# EAGLE schematic ntc08 (EAGLE 6.6.0)

## Sheet 1 of 2
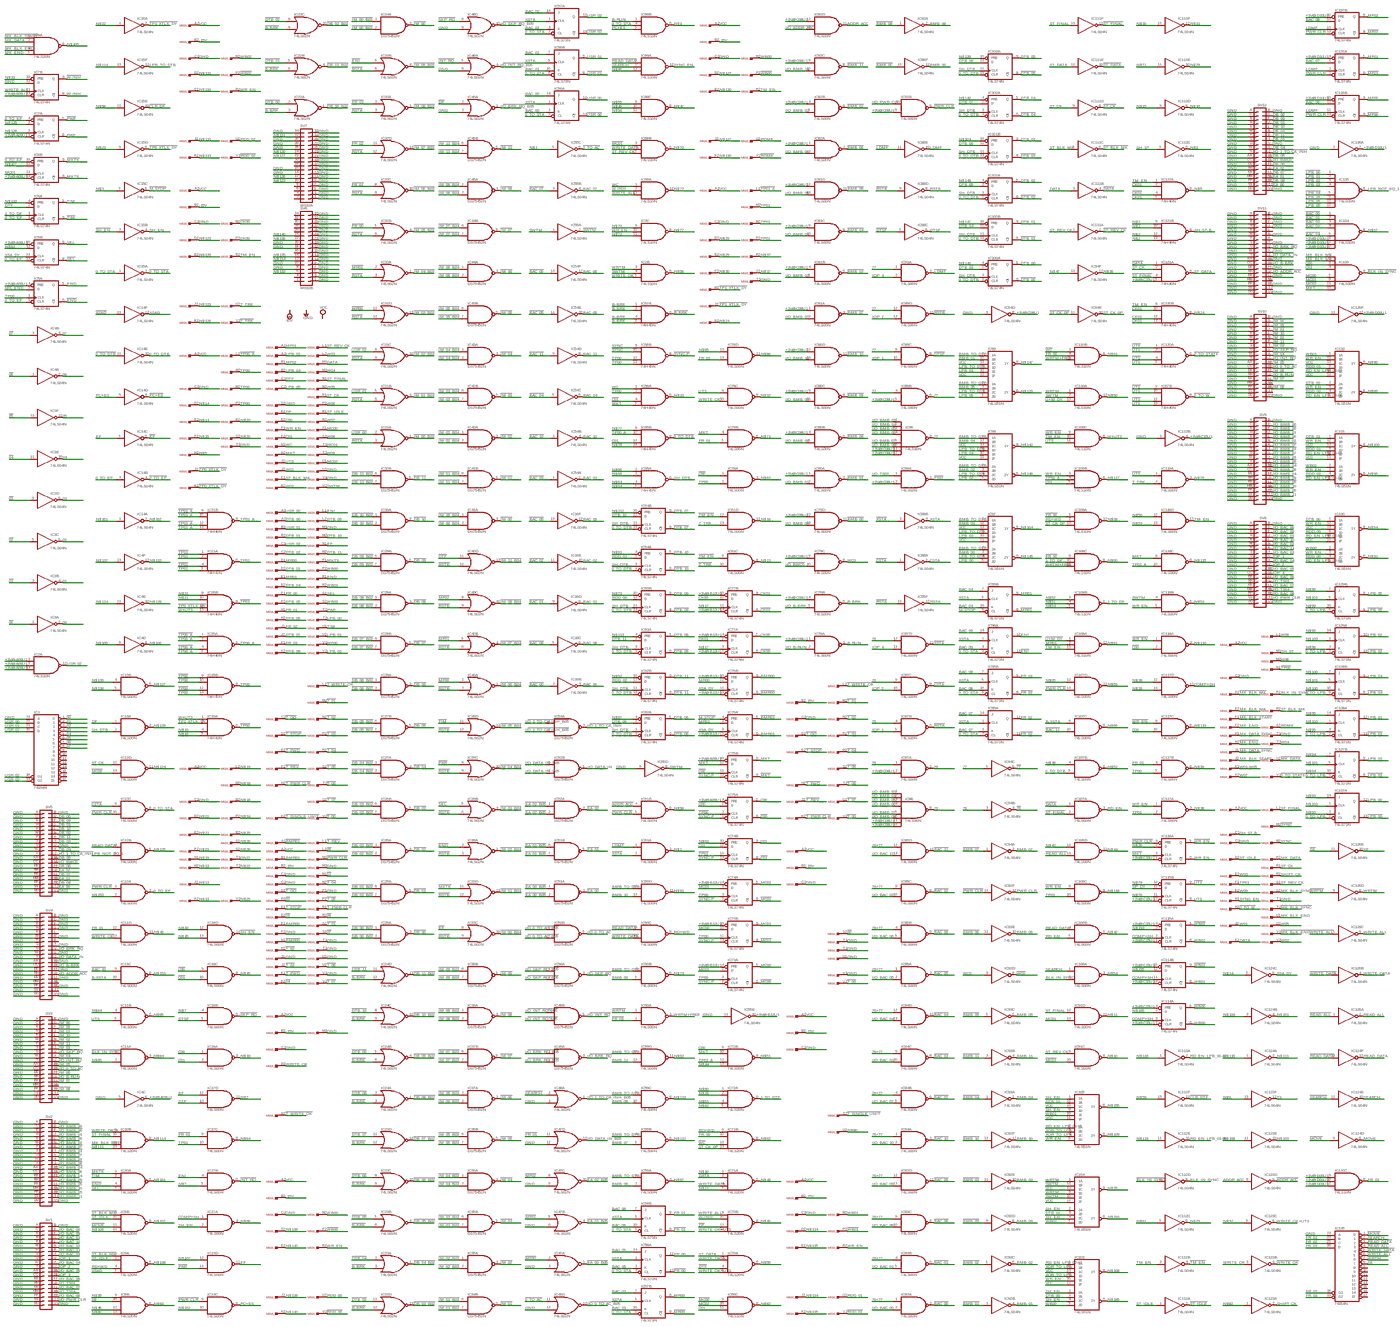
[diagram p0: schematic, sheet 1, overview]
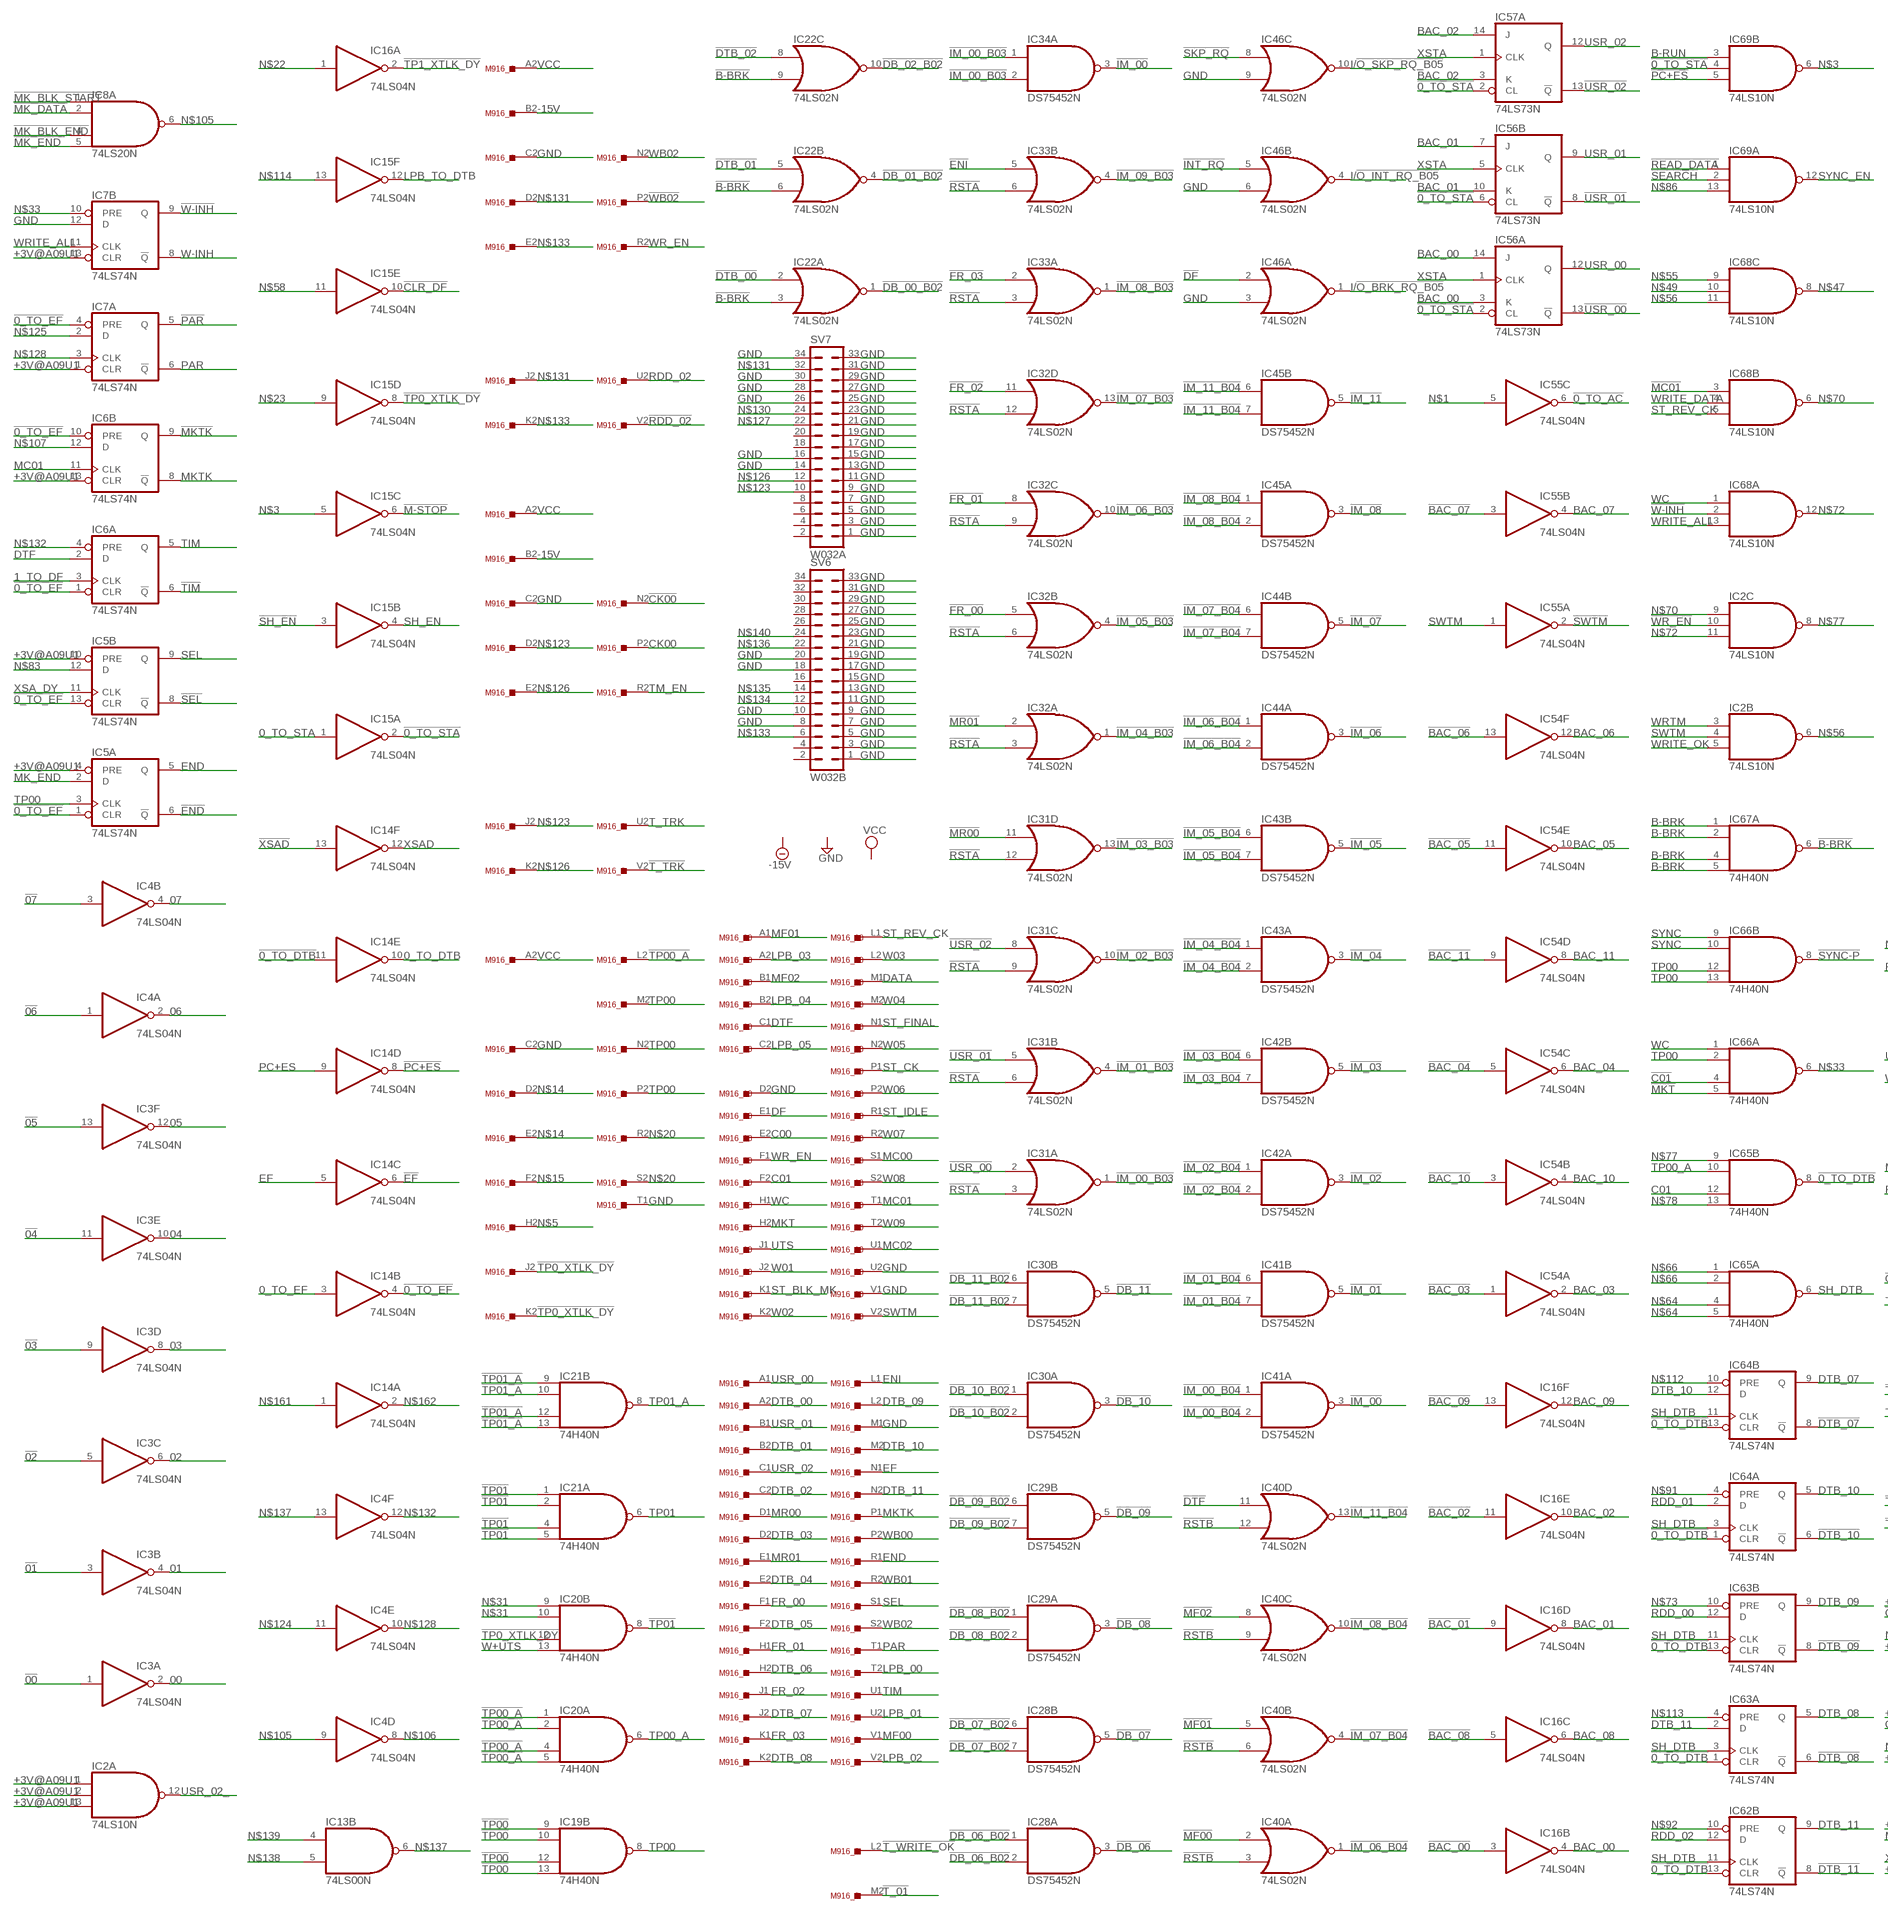
[diagram p1: schematic, sheet 1, part 1 of 4]
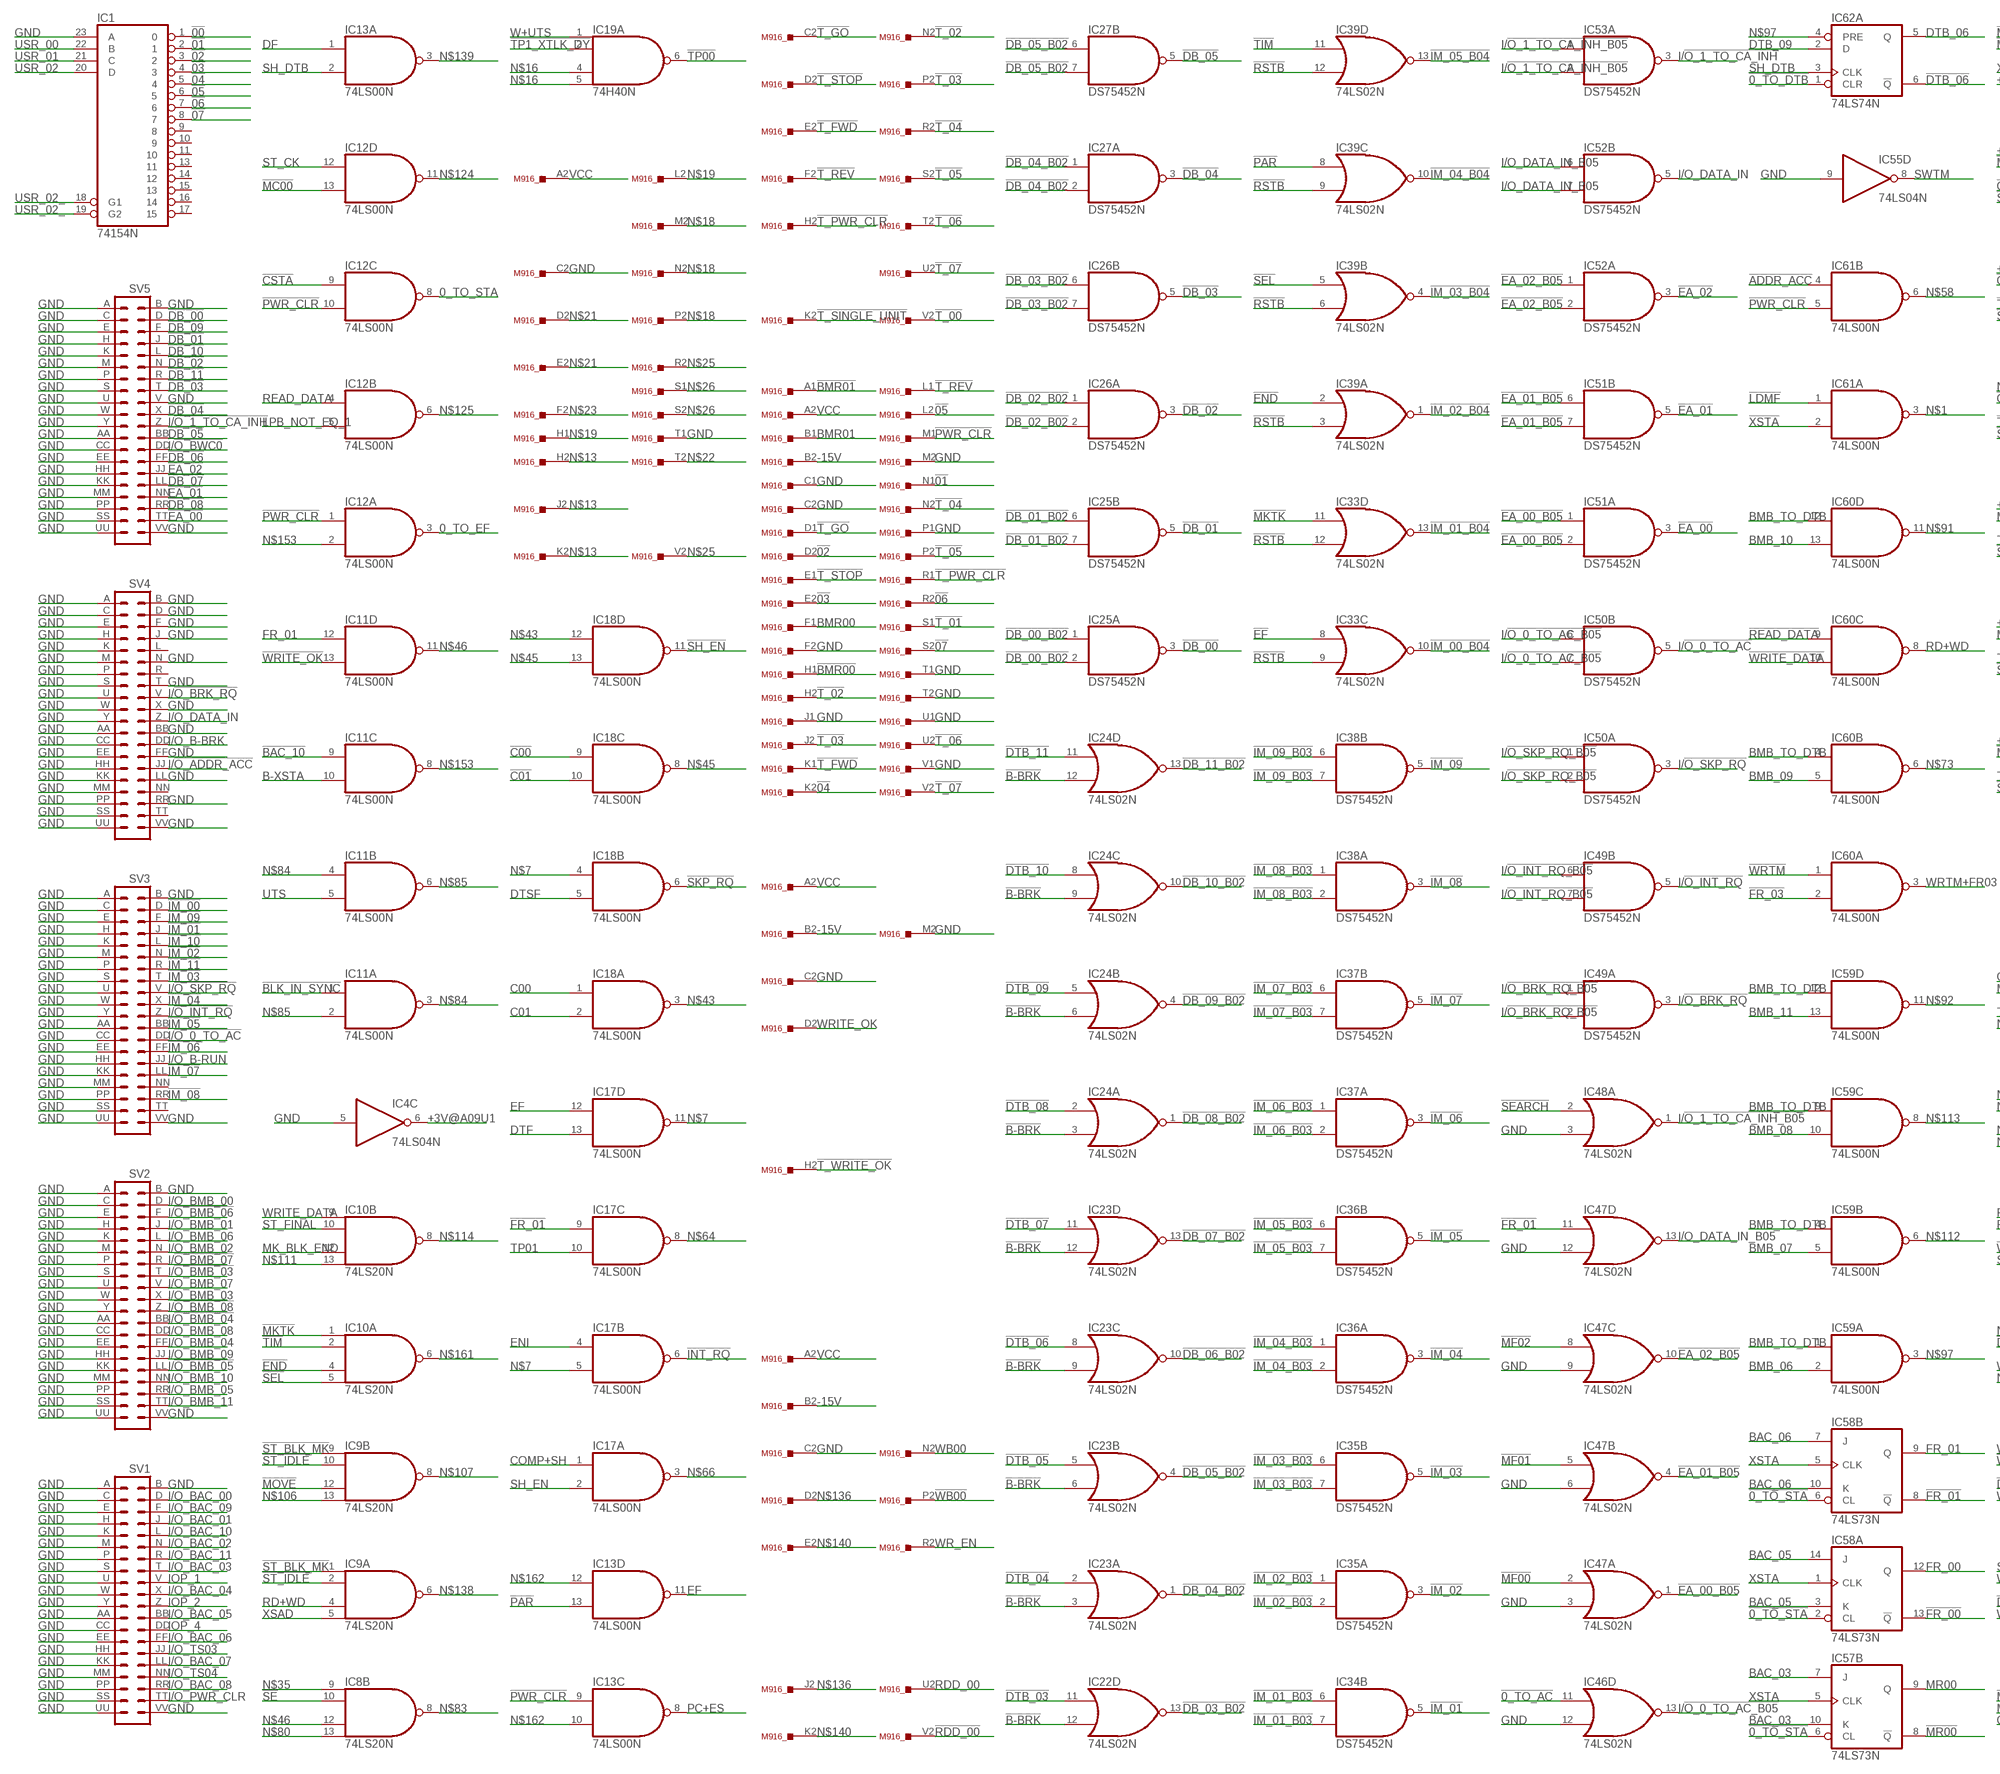
[diagram p2: schematic, sheet 1, part 2 of 4]
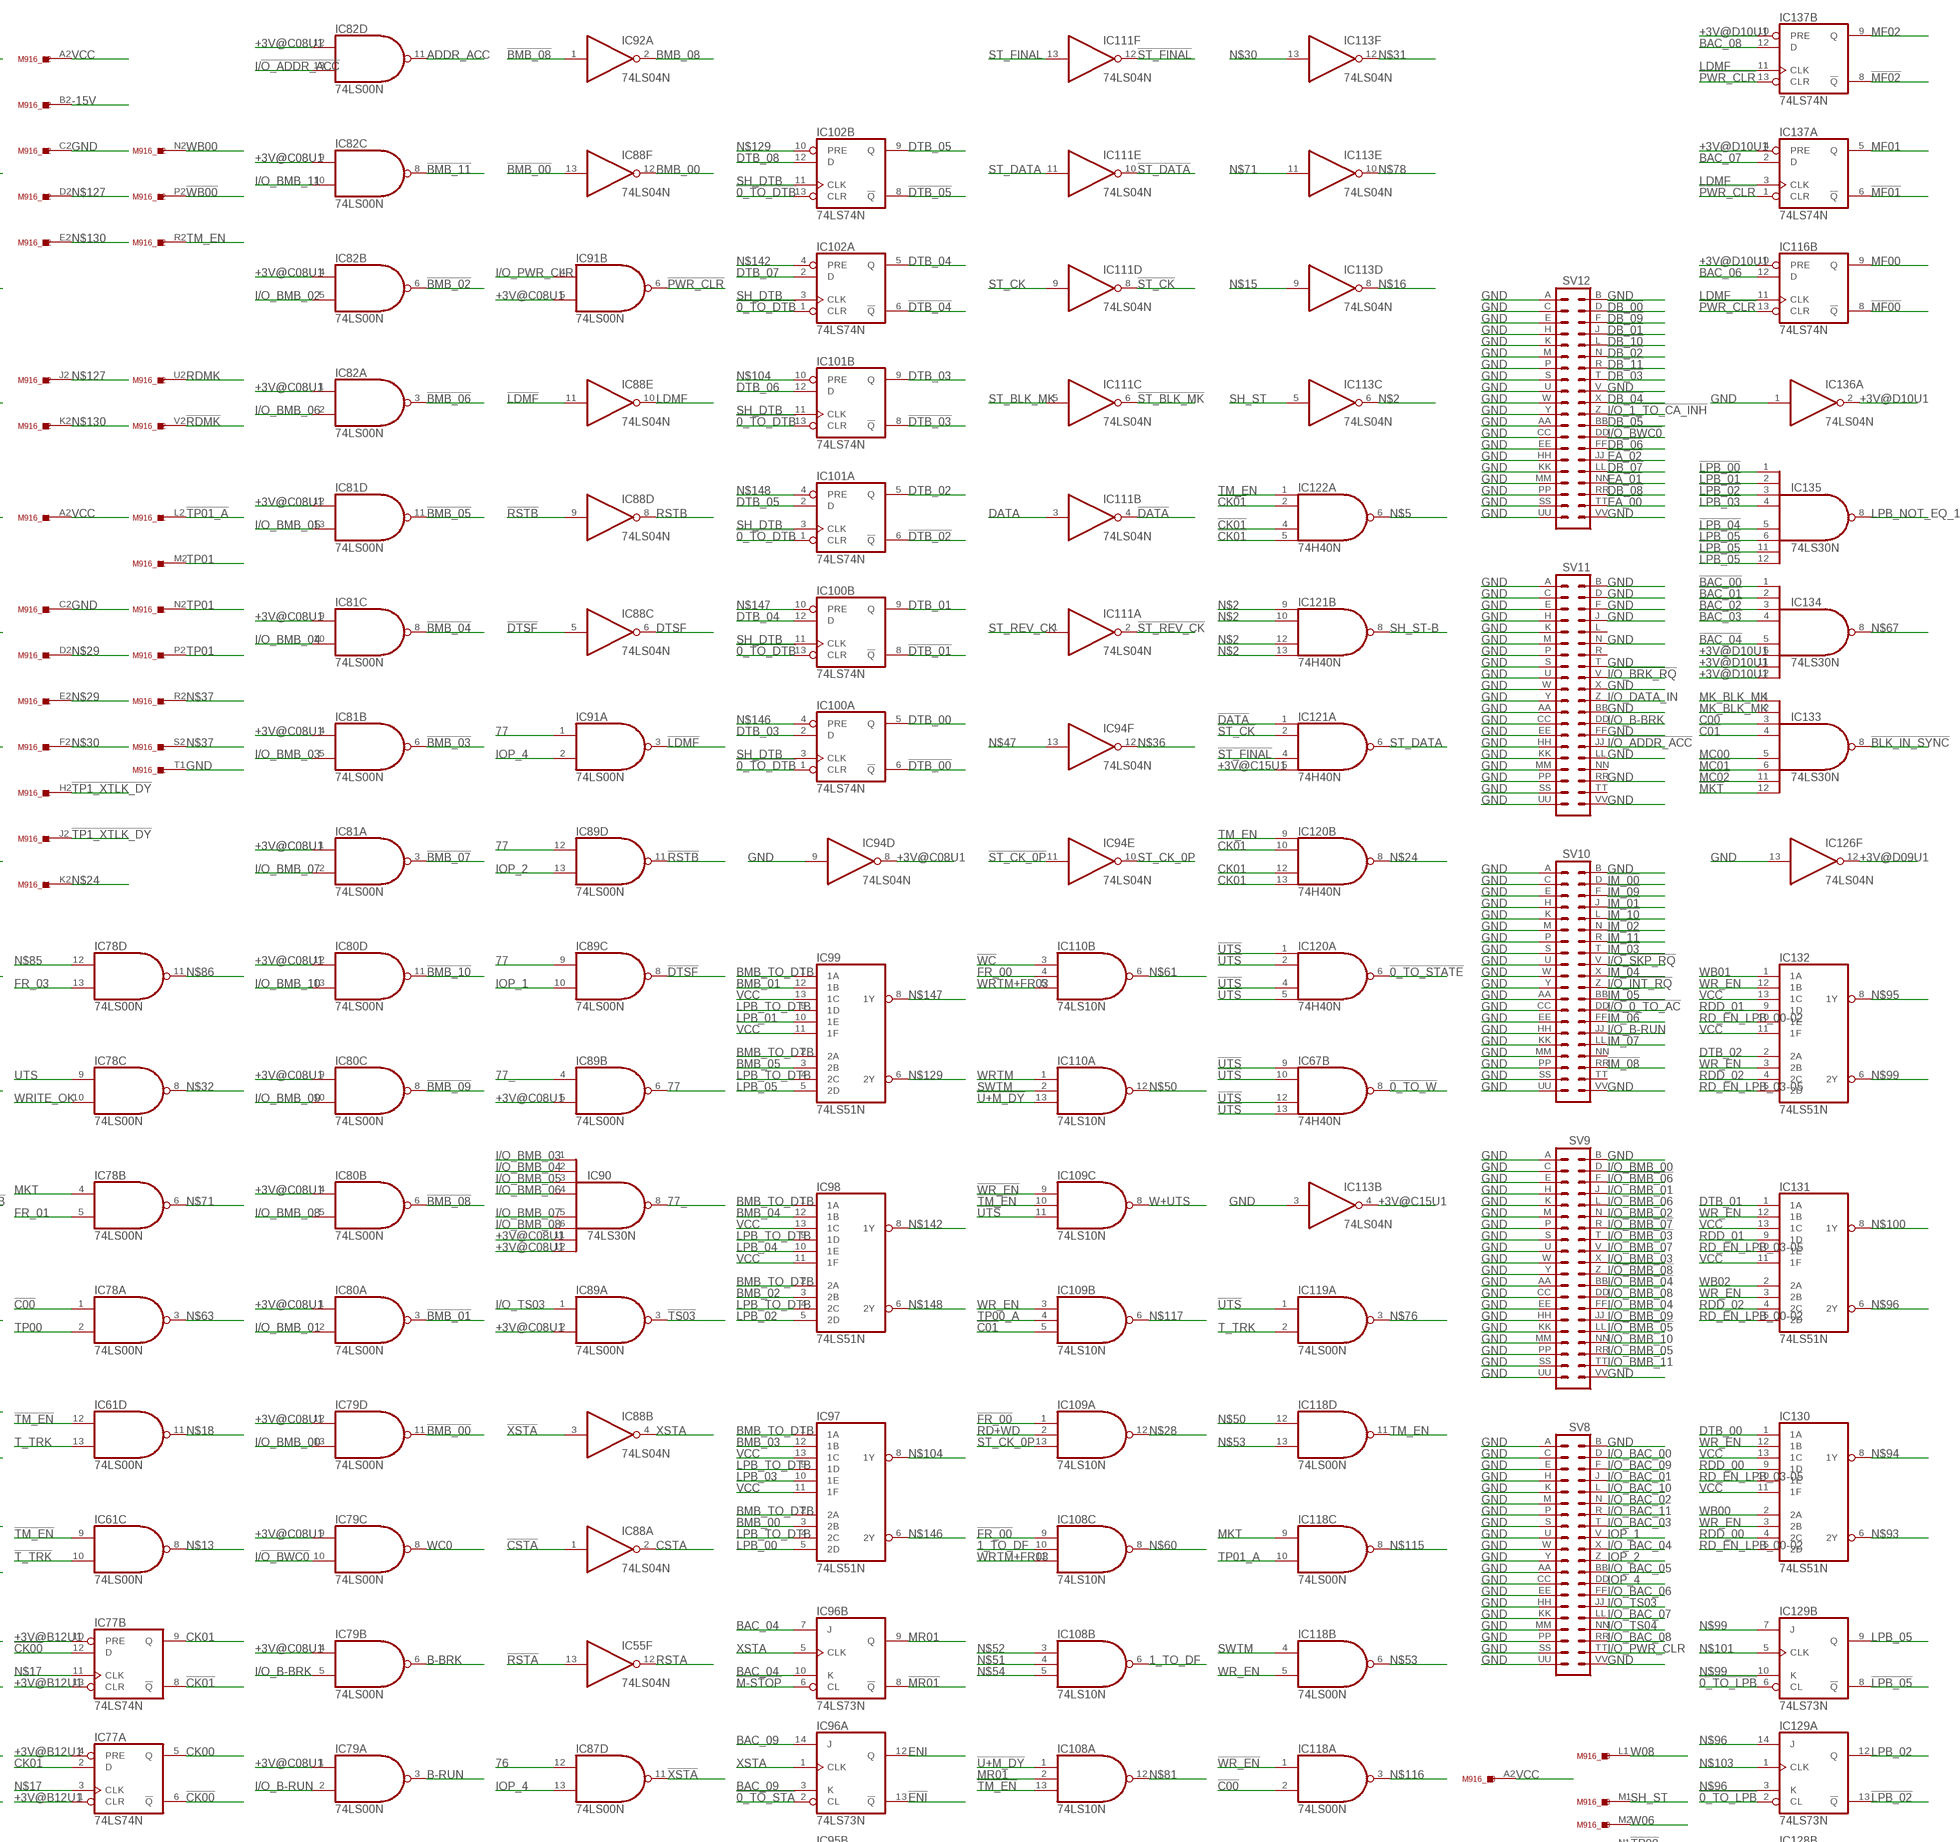
[diagram p3: schematic, sheet 1, part 3 of 4]
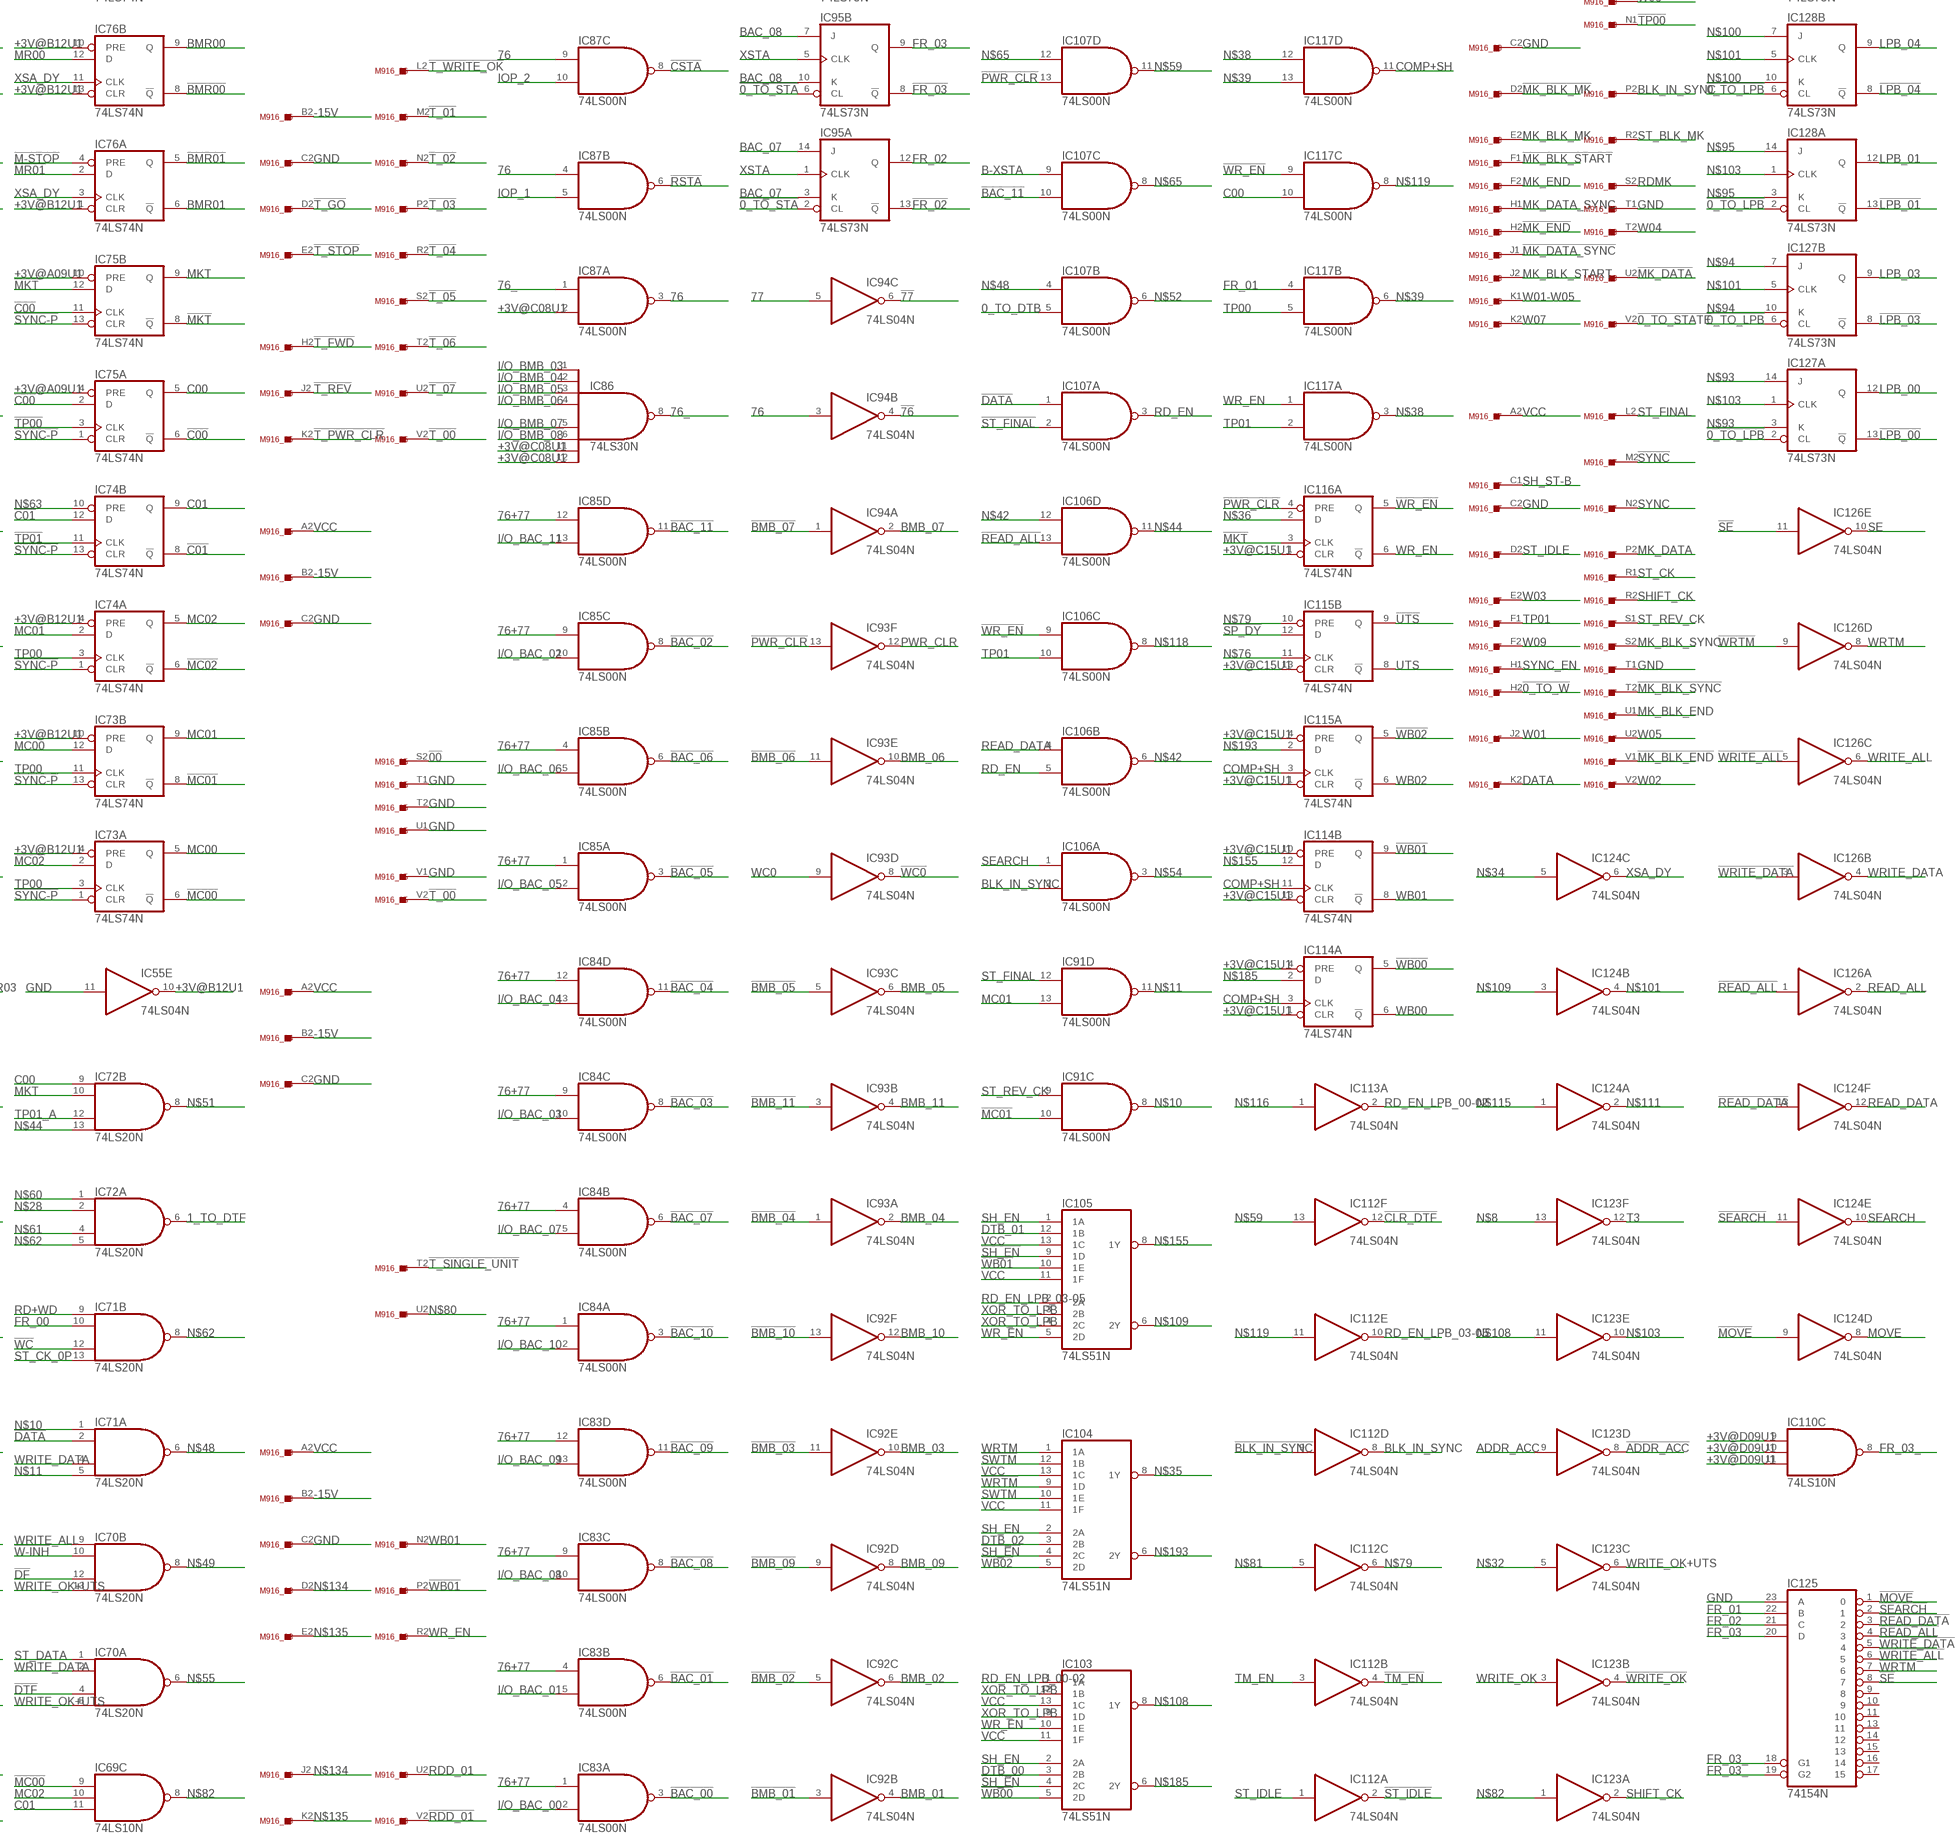
[diagram p4: schematic, sheet 1, part 4 of 4]

### Parts
IC1  74154N  [DIL24-6]
IC2  74LS10N  [DIL14]
IC3  74LS04N  [DIL14]
IC4  74LS04N  [DIL14]
IC5  74LS74N  [DIL14]
IC6  74LS74N  [DIL14]
IC7  74LS74N  [DIL14]
IC8  74LS20N  [DIL14]
IC9  74LS20N  [DIL14]
IC10  74LS20N  [DIL14]
IC11  74LS00N  [DIL14]
IC12  74LS00N  [DIL14]
IC13  74LS00N  [DIL14]
IC14  74LS04N  [DIL14]
IC15  74LS04N  [DIL14]
IC16  74LS04N  [DIL14]
IC17  74LS00N  [DIL14]
IC18  74LS00N  [DIL14]
IC19  74H40N  74S20N  [DIL14]
IC20  74H40N  74S20N  [DIL14]
IC21  74H40N  74S20N  [DIL14]
IC22  74LS02N  [DIL14]
IC23  74LS02N  [DIL14]
IC24  74LS02N  [DIL14]
IC25  DS75452N  [DIL08]
IC26  DS75452N  [DIL08]
IC27  DS75452N  [DIL08]
IC28  DS75452N  [DIL08]
IC29  DS75452N  [DIL08]
IC30  DS75452N  [DIL08]
IC31  74LS02N  [DIL14]
IC32  74LS02N  [DIL14]
IC33  74LS02N  [DIL14]
IC34  DS75452N  [DIL08]
IC35  DS75452N  [DIL08]
IC36  DS75452N  [DIL08]
IC37  DS75452N  [DIL08]
IC38  DS75452N  [DIL08]
IC39  74LS02N  [DIL14]
IC40  74LS02N  [DIL14]
IC41  DS75452N  [DIL08]
IC42  DS75452N  [DIL08]
IC43  DS75452N  [DIL08]
IC44  DS75452N  [DIL08]
IC45  DS75452N  [DIL08]
IC46  74LS02N  [DIL14]
IC47  74LS02N  [DIL14]
IC48  74LS02N  [DIL14]
IC49  DS75452N  [DIL08]
IC50  DS75452N  [DIL08]
IC51  DS75452N  [DIL08]
IC52  DS75452N  [DIL08]
IC53  DS75452N  [DIL08]
IC54  74LS04N  [DIL14]
IC55  74LS04N  [DIL14]
IC56  74LS73N  [DIL14]
IC57  74LS73N  [DIL14]
IC58  74LS73N  [DIL14]
IC59  74LS00N  [DIL14]
IC60  74LS00N  [DIL14]
IC61  74LS00N  [DIL14]
IC62  74LS74N  [DIL14]
IC63  74LS74N  [DIL14]
IC64  74LS74N  [DIL14]
IC65  74H40N  74S20N  [DIL14]
IC66  74H40N  74S20N  [DIL14]
IC67  74H40N  74S20N  [DIL14]
IC68  74LS10N  [DIL14]
IC69  74LS10N  [DIL14]
IC70  74LS20N  [DIL14]
IC71  74LS20N  [DIL14]
IC72  74LS20N  [DIL14]
IC73  74LS74N  [DIL14]
IC74  74LS74N  [DIL14]
IC75  74LS74N  [DIL14]
IC76  74LS74N  [DIL14]
IC77  74LS74N  [DIL14]
IC78  74LS00N  [DIL14]
IC79  74LS00N  [DIL14]
IC80  74LS00N  [DIL14]
IC81  74LS00N  [DIL14]
IC82  74LS00N  [DIL14]
IC83  74LS00N  [DIL14]
IC84  74LS00N  [DIL14]
IC85  74LS00N  [DIL14]
IC86  74LS30N  [DIL14]
IC87  74LS00N  [DIL14]
IC88  74LS04N  [DIL14]
IC89  74LS00N  [DIL14]
IC90  74LS30N  [DIL14]
IC91  74LS00N  [DIL14]
IC92  74LS04N  [DIL14]
IC93  74LS04N  [DIL14]
IC94  74LS04N  [DIL14]
IC95  74LS73N  [DIL14]
IC96  74LS73N  [DIL14]
IC97  74LS51N  [DIL14]
IC98  74LS51N  [DIL14]
IC99  74LS51N  [DIL14]
IC100  74LS74N  [DIL14]
IC101  74LS74N  [DIL14]
IC102  74LS74N  [DIL14]
IC103  74LS51N  [DIL14]
IC104  74LS51N  [DIL14]
IC105  74LS51N  [DIL14]
IC106  74LS00N  [DIL14]
IC107  74LS00N  [DIL14]
IC108  74LS10N  [DIL14]
IC109  74LS10N  [DIL14]
IC110  74LS10N  [DIL14]
IC111  74LS04N  [DIL14]
IC112  74LS04N  [DIL14]
IC113  74LS04N  [DIL14]
IC114  74LS74N  [DIL14]
IC115  74LS74N  [DIL14]
IC116  74LS74N  [DIL14]
IC117  74LS00N  [DIL14]
IC118  74LS00N  [DIL14]
IC119  74LS00N  [DIL14]
IC120  74H40N  74S20N  [DIL14]
IC121  74H40N  74S20N  [DIL14]
IC122  74H40N  74S20N  [DIL14]
IC123  74LS04N  [DIL14]
IC124  74LS04N  [DIL14]
IC125  74154N  [DIL24-6]
IC126  74LS04N  [DIL14]
IC127  74LS73N  [DIL14]
IC128  74LS73N  [DIL14]
IC129  74LS73N  [DIL14]
IC130  74LS51N  [DIL14]
IC131  74LS51N  [DIL14]
IC132  74LS51N  [DIL14]
IC133  74LS30N  [DIL14]
IC134  74LS30N  [DIL14]
IC135  74LS30N  [DIL14]
IC136  74LS04N  [DIL14]
IC137  74LS74N  [DIL14]
M916_1  M302  M916  [H807]
M916_2  M602  M916  [H807]
M916_3  G888  M916  [H807]
M916_4  M302  M916  [H807]
M916_5  G888  M916  [H807]
M916_6  G888  M916  [H807]
M916_7  M633  M916  [H807]
M916_8  W023  M916  [H807]
M916_9  M916  [H807]
M916_10  M916  [H807]
M916_11  M602  M916  [H807]
M916_12  G888  M916  [H807]
M916_13  G888  M916  [H807]
M916_14  G879  M916  [H807]
M916_15  M633  M916  [H807]
M916_16  W005  M916  [H807]
M916_17  M228B  M916  [H807]
M916_18  M228A  M916  [H807]
SV1  DEC40PINV  [DEC40PINV]
SV2  DEC40PINV  [DEC40PINV]
SV3  DEC40PINV  [DEC40PINV]
SV4  DEC40PINV  [DEC40PINV]
SV5  DEC40PINV  [DEC40PINV]
SV6  W032B  MA17-2  [MA17-2]
SV7  W032A  MA17-2  [MA17-2]
SV8  DEC40PINV  [DEC40PINV]
SV9  DEC40PINV  [DEC40PINV]
SV10  DEC40PINV  [DEC40PINV]
SV11  DEC40PINV  [DEC40PINV]
SV12  DEC40PINV  [DEC40PINV]

### Nets
00: IC3.2(A:O)
0_TO_DTB: IC14.10(E:O) IC107.5(B:I1)
0_TO_EF: IC12.3(A:O) IC14.3(B:I)
0_TO_STA: IC12.8(C:O) IC15.1(A:I)
01: IC3.4(B:O)
1_TO_DF: IC6.3(A:CLK) IC108.6(B:O) IC108.10(C:I1) ; also sheet 2
1_TO_DTF: IC72.6(A:O) ; also sheet 2
02: IC3.6(C:O)
03: IC3.8(D:O)
04: IC3.10(E:O)
05: IC3.12(F:O)
06: IC4.2(A:O)
07: IC4.4(B:O)
76: IC87.3(A:O) IC87.4(B:I0) IC87.9(C:I0) IC87.12(D:I0) IC94.3(B:I)
76+77: IC83.1(A:I0) IC83.4(B:I0) IC83.9(C:I0) IC83.12(D:I0) IC84.1(A:I0) IC84.4(B:I0) IC84.9(C:I0) IC84.12(D:I0) IC85.1(A:I0) IC85.4(B:I0) IC85.9(C:I0) IC85.12(D:I0) ; also sheet 2
76_: IC86.8(O) IC87.1(A:I0)
77: IC89.6(B:O) IC89.9(C:I0) IC89.12(D:I0) IC91.1(A:I0) IC94.5(C:I)
77_: IC89.4(B:I0) IC90.8(O)
!00: IC1.1 IC3.1(A:I) M916_15.S2
!0_TO_AC: IC46.11(D:I0) IC55.6(C:O)
!0_TO_DTB: IC14.11(E:I) IC62.1(A:CLR) IC62.13(B:CLR) IC63.1(A:CLR) IC63.13(B:CLR) IC64.1(A:CLR) IC64.13(B:CLR) IC65.8(B:O) IC100.1(A:CLR) IC100.13(B:CLR) IC101.1(A:CLR) IC101.13(B:CLR) IC102.1(A:CLR) IC102.13(B:CLR)
!0_TO_EF: IC5.1(A:CLR) IC5.13(B:CLR) IC6.1(A:CLR) IC6.10(B:PRE) IC7.4(A:PRE) IC14.4(B:O)
!0_TO_LPB: IC127.2(A:CL) IC127.6(B:CL) IC128.2(A:CL) IC128.6(B:CL) IC129.2(A:CL) IC129.6(B:CL) ; also sheet 2
!0_TO_STA: IC15.2(A:O) IC56.2(A:CL) IC56.6(B:CL) IC57.2(A:CL) IC57.6(B:CL) IC58.2(A:CL) IC58.6(B:CL) IC69.4(B:I1) IC95.2(A:CL) IC95.6(B:CL) IC96.2(A:CL)
!0_TO_STATE: IC120.6(A:O) M916_18.V2
!0_TO_W: IC67.8(B:O) M916_17.H2
!01: IC1.2 IC3.3(B:I) M916_7.N1
!02: IC1.3 IC3.5(C:I) M916_7.D2
!03: IC1.4 IC3.9(D:I) M916_7.E2
!04: IC1.5 IC3.11(E:I) M916_7.K2
!05: IC1.6 IC3.13(F:I) M916_7.L2
!06: IC1.7 IC4.1(A:I) M916_7.R2
!07: IC1.8 IC4.3(B:I) M916_7.S2
!76: IC94.4(B:O) ; also sheet 2
!77: IC94.6(C:O) ; also sheet 2
!ADDR_ACC: IC61.4(B:I0) IC123.8(D:O)
!B-BRK: IC22.3(A:I1) IC22.6(B:I1) IC22.9(C:I1) IC22.12(D:I1) IC23.3(A:I1) IC23.6(B:I1) IC23.9(C:I1) IC23.12(D:I1) IC24.3(A:I1) IC24.6(B:I1) IC24.9(C:I1) IC24.12(D:I1) IC67.6(A:O)
!BAC_00: IC16.3(B:I) IC83.3(A:O) IC134.1(I0)
!BAC_01: IC16.9(D:I) IC83.6(B:O) IC134.2(I1)
!BAC_02: IC16.11(E:I) IC85.8(C:O) IC134.3(I2)
!BAC_03: IC54.1(A:I) IC84.8(C:O) IC134.4(I3)
!BAC_04: IC54.5(C:I) IC84.11(D:O) IC134.5(I4)
!BAC_05: IC54.11(E:I) IC85.3(A:O)
!BAC_06: IC54.13(F:I) IC85.6(B:O)
!BAC_07: IC55.3(B:I) IC84.6(B:O)
!BAC_08: IC16.5(C:I) IC83.8(C:O)
!BAC_09: IC16.13(F:I) IC83.11(D:O)
!BAC_10: IC11.9(C:I0) IC54.3(B:I) IC84.3(A:O)
!BAC_11: IC54.9(D:I) IC85.11(D:O) IC107.10(C:I1)
!BLK_IN_SYNC: IC11.1(A:I0) IC112.9(D:I) IC133.8(O)
!BMB_00: IC79.11(D:O) IC88.13(F:I)
!BMB_01: IC80.3(A:O) IC92.3(B:I)
!BMB_02: IC82.6(B:O) IC92.5(C:I)
!BMB_03: IC81.6(B:O) IC92.11(E:I)
!BMB_04: IC81.8(C:O) IC93.1(A:I)
!BMB_05: IC81.11(D:O) IC93.5(C:I)
!BMB_06: IC82.3(A:O) IC93.11(E:I)
!BMB_07: IC81.3(A:O) IC94.1(A:I)
!BMB_08: IC80.6(B:O) IC92.1(A:I)
!BMB_09: IC80.8(C:O) IC92.9(D:I)
!BMB_10: IC80.11(D:O) IC92.13(F:I)
!BMB_11: IC82.8(C:O) IC93.3(B:I)
!BMR00: IC76.8(B:!Q) M916_7.H1
!BMR01: IC76.5(A:Q) M916_7.A1
!C00: IC18.9(C:I0) IC75.2(A:D) IC75.6(A:!Q) IC75.11(B:CLK) IC78.1(A:I0) IC118.2(A:I1)
!C01: IC18.10(C:I1) IC66.4(A:I2) IC74.8(B:!Q) IC74.12(B:D) IC109.5(B:I2) IC133.4(I3)
!CK00: IC77.6(A:!Q) IC77.12(B:D) M916_3.N2
!CK01: IC77.8(B:!Q) IC122.2(A:I1) IC122.4(A:I2) IC122.5(A:I3)
!CLR_DF: IC15.10(E:O) ; also sheet 2
!CLR_DTF: IC112.12(F:O) ; also sheet 2
!CSTA: IC12.9(C:I0) IC87.8(C:O) IC88.1(A:I)
!DATA: IC71.2(A:I1) IC107.1(A:I0) IC111.4(B:O) IC121.1(A:I0)
!DB_00: IC25.3(A:O) SV5.D SV12.D
!DB_00_B02: IC22.1(A:O) IC25.1(A:I0) IC25.2(A:I1)
!DB_01: IC25.5(B:O) SV5.J SV12.J
!DB_01_B02: IC22.4(B:O) IC25.6(B:I0) IC25.7(B:I1)
!DB_02: IC26.3(A:O) SV5.N SV12.N
!DB_02_B02: IC22.10(C:O) IC26.1(A:I0) IC26.2(A:I1)
!DB_03: IC26.5(B:O) SV5.T SV12.T
!DB_03_B02: IC22.13(D:O) IC26.6(B:I0) IC26.7(B:I1)
!DB_04: IC27.3(A:O) SV5.X SV12.X
!DB_04_B02: IC23.1(A:O) IC27.1(A:I0) IC27.2(A:I1)
!DB_05: IC27.5(B:O) SV5.BB SV12.BB
!DB_05_B02: IC23.4(B:O) IC27.6(B:I0) IC27.7(B:I1)
!DB_06: IC28.3(A:O) SV5.FF SV12.FF
!DB_06_B02: IC23.10(C:O) IC28.1(A:I0) IC28.2(A:I1)
!DB_07: IC28.5(B:O) SV5.LL SV12.LL
!DB_07_B02: IC23.13(D:O) IC28.6(B:I0) IC28.7(B:I1)
!DB_08: IC29.3(A:O) SV5.RR SV12.RR
!DB_08_B02: IC24.1(A:O) IC29.1(A:I0) IC29.2(A:I1)
!DB_09: IC29.5(B:O) SV5.F SV12.F
!DB_09_B02: IC24.4(B:O) IC29.6(B:I0) IC29.7(B:I1)
!DB_10: IC30.3(A:O) SV5.L SV12.L
!DB_10_B02: IC24.10(C:O) IC30.1(A:I0) IC30.2(A:I1)
!DB_11: IC30.5(B:O) SV5.R SV12.R
!DB_11_B02: IC24.13(D:O) IC30.6(B:I0) IC30.7(B:I1)
!DF: IC46.2(A:I0) IC70.12(B:I2) ; also sheet 2
!DTB_00: IC22.2(A:I0) IC100.6(A:!Q)
!DTB_01: IC22.5(B:I0) IC100.8(B:!Q)
!DTB_02: IC22.8(C:I0) IC101.6(A:!Q)
!DTB_03: IC22.11(D:I0) IC101.8(B:!Q)
!DTB_04: IC23.2(A:I0) IC102.6(A:!Q)
!DTB_05: IC23.5(B:I0) IC102.8(B:!Q)
!DTB_06: IC23.8(C:I0) IC62.6(A:!Q)
!DTB_07: IC23.11(D:I0) IC64.8(B:!Q)
!DTB_08: IC24.2(A:I0) IC63.6(A:!Q)
!DTB_09: IC24.5(B:I0) IC63.8(B:!Q)
!DTB_10: IC24.8(C:I0) IC64.6(A:!Q)
!DTB_11: IC24.11(D:I0) IC62.8(B:!Q)
!DTF: IC40.11(D:I0) IC70.4(A:I2) ; also sheet 2
!DTSF: IC88.5(C:I) IC89.8(C:O)
!EA_00: IC51.3(A:O) SV5.TT SV12.TT
!EA_00_B05: IC47.1(A:O) IC51.1(A:I0) IC51.2(A:I1)
!EA_01: IC51.5(B:O) SV5.NN SV12.NN
!EA_01_B05: IC47.4(B:O) IC51.6(B:I0) IC51.7(B:I1)
!EA_02: IC52.3(A:O) SV5.JJ SV12.JJ
!EA_02_B05: IC47.10(C:O) IC52.1(A:I0) IC52.2(A:I1)
!EF: IC14.6(C:O) IC33.8(C:I0)
!END: IC5.6(A:!Q) IC10.4(A:I2) IC39.2(A:I0)
!ENI: IC33.5(B:I0) IC96.13(A:!Q)
!FR_00: IC32.5(B:I0) IC58.13(A:!Q) IC108.9(C:I0) IC109.1(A:I0)
!FR_01: IC17.9(C:I0) IC32.8(C:I0) IC47.11(D:I0) IC58.8(B:!Q)
!FR_02: IC32.11(D:I0) IC95.13(A:!Q)
!FR_03: IC33.2(A:I0) IC60.2(A:I1) IC95.8(B:!Q)
!IM_00: IC34.3(A:O) IC41.3(A:O) SV3.D SV10.D
!IM_00_B03: IC31.1(A:O) IC34.1(A:I0) IC34.2(A:I1)
!IM_00_B04: IC33.10(C:O) IC41.1(A:I0) IC41.2(A:I1)
!IM_01: IC34.5(B:O) IC41.5(B:O) SV3.J SV10.J
!IM_01_B03: IC31.4(B:O) IC34.6(B:I0) IC34.7(B:I1)
!IM_01_B04: IC33.13(D:O) IC41.6(B:I0) IC41.7(B:I1)
!IM_02: IC35.3(A:O) IC42.3(A:O) SV3.N SV10.N
!IM_02_B03: IC31.10(C:O) IC35.1(A:I0) IC35.2(A:I1)
!IM_02_B04: IC39.1(A:O) IC42.1(A:I0) IC42.2(A:I1)
!IM_03: IC35.5(B:O) IC42.5(B:O) SV3.T SV10.T
!IM_03_B03: IC31.13(D:O) IC35.6(B:I0) IC35.7(B:I1)
!IM_03_B04: IC39.4(B:O) IC42.6(B:I0) IC42.7(B:I1)
!IM_04: IC36.3(A:O) IC43.3(A:O) SV3.X SV10.X
!IM_04_B03: IC32.1(A:O) IC36.1(A:I0) IC36.2(A:I1)
!IM_04_B04: IC39.10(C:O) IC43.1(A:I0) IC43.2(A:I1)
!IM_05: IC36.5(B:O) IC43.5(B:O) SV3.BB SV10.BB
!IM_05_B03: IC32.4(B:O) IC36.6(B:I0) IC36.7(B:I1)
!IM_05_B04: IC39.13(D:O) IC43.6(B:I0) IC43.7(B:I1)
!IM_06: IC37.3(A:O) IC44.3(A:O) SV3.FF SV10.FF
!IM_06_B03: IC32.10(C:O) IC37.1(A:I0) IC37.2(A:I1)
!IM_06_B04: IC40.1(A:O) IC44.1(A:I0) IC44.2(A:I1)
!IM_07: IC37.5(B:O) IC44.5(B:O) SV3.LL SV10.LL
!IM_07_B03: IC32.13(D:O) IC37.6(B:I0) IC37.7(B:I1)
!IM_07_B04: IC40.4(B:O) IC44.6(B:I0) IC44.7(B:I1)
!IM_08: IC38.3(A:O) IC45.3(A:O) SV3.RR SV10.RR
!IM_08_B03: IC33.1(A:O) IC38.1(A:I0) IC38.2(A:I1)
!IM_08_B04: IC40.10(C:O) IC45.1(A:I0) IC45.2(A:I1)
!IM_09: IC38.5(B:O) SV3.F SV10.F
!IM_09_B03: IC33.4(B:O) IC38.6(B:I0) IC38.7(B:I1)
!IM_10: SV3.L SV10.L
!IM_11: IC45.5(B:O) SV3.R SV10.R
!IM_11_B04: IC40.13(D:O) IC45.6(B:I0) IC45.7(B:I1)
!INT_RQ: IC17.6(B:O) IC46.5(B:I0)
!LDMF: IC61.1(A:I0) IC88.11(E:I) IC91.3(A:O)
!LPB_00: IC127.13(A:!Q) IC135.1(I0)
!LPB_01: IC128.13(A:!Q) IC135.2(I1)
!LPB_02: IC129.13(A:!Q) IC135.3(I2)
!LPB_03: IC127.8(B:!Q) IC135.4(I3)
!LPB_04: IC128.8(B:!Q) IC135.5(I4)
!LPB_05: IC129.8(B:!Q) IC135.6(I5) IC135.11(I6) IC135.12(I7)
!M-STOP: IC15.6(C:O) IC76.4(A:PRE) IC96.6(B:CL) ; also sheet 2
!MC00: IC12.13(D:I1) IC69.9(C:I0) IC73.6(A:!Q)
!MC01: IC68.3(B:I0) IC73.8(B:!Q) IC91.10(C:I1) IC133.6(I5)
!MC02: IC73.2(A:D) IC74.6(A:!Q) IC133.11(I6)
!MF00: IC40.2(A:I0) IC47.2(A:I0) IC116.8(B:!Q)
!MF01: IC40.5(B:I0) IC47.5(B:I0) IC137.6(A:!Q)
!MF02: IC40.8(C:I0) IC47.8(C:I0) IC137.8(B:!Q)
!MK_BLK_END: IC8.4(A:I2) M916_17.V1
!MK_BLK_MK: M916_18.D2
!MK_BLK_START: IC8.1(A:I0) M916_18.F1
!MK_BLK_SYNC: M916_17.T2
!MK_DATA: IC8.2(A:I1) M916_18.U2
!MK_DATA_SYNC: M916_18.J1
!MK_END: IC8.5(A:I3) M916_18.H2
!MKT: IC66.5(A:I3) IC75.8(B:!Q) IC75.12(B:D) IC116.3(A:CLK) IC133.12(I7)
!MKTK: IC6.9(B:Q) IC10.1(A:I0) IC33.11(D:I0)
!MOVE: IC9.12(B:I2) IC124.9(D:I) IC125.1
!MR00: IC31.11(D:I0) IC57.8(B:!Q)
!MR01: IC32.2(A:I0) IC76.2(A:D) IC96.8(B:!Q)
!PAR: IC7.5(A:Q) IC13.13(D:I1) IC39.8(C:I0)
!PC+ES: IC14.8(D:O) IC69.5(B:I2)
!PWR_CLR: IC12.1(A:I0) IC12.10(C:I1) IC13.9(C:I0) IC61.5(B:I1) IC91.6(B:O) IC93.13(F:I) IC107.13(D:I1) IC116.4(A:PRE) IC116.13(B:CLR) IC137.1(A:CLR) IC137.13(B:CLR) M916_7.M1
!RDD_00: M916_5.V2
!RDD_01: M916_13.V2
!RDD_02: M916_4.V2
!RDMK: M916_12.V2
!READ_ALL: IC106.13(D:I1) IC125.4 IC126.1(A:I)
!READ_DATA: IC60.9(C:I0) IC69.1(A:I0) IC124.13(F:I) IC125.3
!RSTA: IC31.3(A:I1) IC31.6(B:I1) IC31.9(C:I1) IC31.12(D:I1) IC32.3(A:I1) IC32.6(B:I1) IC32.9(C:I1) IC32.12(D:I1) IC33.3(A:I1) IC33.6(B:I1) IC55.13(F:I) IC87.6(B:O)
!RSTB: IC33.9(C:I1) IC33.12(D:I1) IC39.3(A:I1) IC39.6(B:I1) IC39.9(C:I1) IC39.12(D:I1) IC40.3(A:I1) IC40.6(B:I1) IC40.9(C:I1) IC40.12(D:I1) IC88.9(D:I) IC89.11(D:O)
!SE: IC8.10(B:I1) IC125.8 IC126.11(E:I)
!SEARCH: IC48.2(A:I0) IC69.2(A:I1) IC124.11(E:I) IC125.2
!SEL: IC5.8(B:!Q) IC10.5(A:I3) IC39.5(B:I0)
!SH_EN: IC15.3(B:I) IC18.11(D:O) IC103.4(2C) IC104.4(2C) IC105.9(1D)
!SKP_RQ: IC18.6(B:O) IC46.8(C:I0)
!SP_DY: IC115.12(B:D) ; also sheet 2
!ST_BLK_MK: IC9.1(A:I0) IC9.9(B:I0) IC111.6(C:O)
!ST_CK: IC111.8(D:O) IC121.2(A:I1)
!ST_CK_0P: IC94.11(E:I) ; also sheet 2
!ST_DATA: IC111.10(E:O)
!ST_FINAL: IC107.2(A:I1) IC111.12(F:O) IC121.4(A:I2)
!ST_IDLE: IC9.2(A:I1) IC9.10(B:I1) IC112.2(A:O)
!ST_REV_CK: IC111.2(A:O)
!SWTM: IC55.2(A:O) IC104.12(1B)
!SYNC: M916_17.M2
!SYNC-P: IC66.8(B:O) IC73.1(A:CLR) IC73.13(B:CLR) IC74.1(A:CLR) IC74.13(B:CLR) IC75.1(A:CLR) IC75.13(B:CLR)
!T_00: M916_8.V2 M916_15.V2 M916_16.V2
!T_01: M916_7.S1 M916_8.M2 M916_16.M2
!T_02: M916_7.H2 M916_8.N2 M916_16.N2
!T_03: M916_7.J2 M916_8.P2 M916_16.P2
!T_04: M916_7.N2 M916_8.R2 M916_16.R2
!T_05: M916_7.P2 M916_8.S2 M916_16.S2
!T_06: M916_7.U2 M916_8.T2 M916_16.T2
!T_07: M916_7.V2 M916_8.U2 M916_16.U2
!T_FWD: M916_7.K1 M916_8.E2 M916_16.H2
!T_GO: M916_7.D1 M916_8.C2 M916_16.D2
!T_PWR_CLR: M916_7.R1 M916_8.H2 M916_16.K2
!T_REV: M916_7.L1 M916_8.F2 M916_16.J2
!T_SINGLE_UNIT: M916_8.K2 M916_14.T2
!T_STOP: M916_7.E1 M916_8.D2 M916_16.E2
!T_TRK: IC61.10(C:I1) M916_3.V2
!T_WRITE_OK: M916_6.H2 M916_8.L2 M916_16.L2
!TIM: IC6.6(A:!Q) IC10.2(A:I1) IC39.11(D:I0)
!TM_EN: IC61.9(C:I0) IC61.12(D:I0) IC108.13(A:I2) IC109.10(C:I1) IC112.4(B:O) ; also sheet 2
!TP00: IC19.6(A:O) IC19.9(B:I0) IC19.10(B:I1) IC19.12(B:I2) IC19.13(B:I3) IC75.3(A:CLK) M916_18.N1
!TP00_A: IC20.1(A:I0) IC20.2(A:I1) IC20.4(A:I2) IC20.5(A:I3) M916_2.L2
!TP0_XTLK_DY: IC15.8(D:O) IC20.12(B:I2) M916_2.J2 M916_2.K2
!TP01: IC20.8(B:O) IC21.1(A:I0) IC21.2(A:I1) IC21.4(A:I2) IC21.5(A:I3) IC74.11(B:CLK)
!TP01_A: IC21.9(B:I0) IC21.10(B:I1) IC21.12(B:I2) IC21.13(B:I3) M916_11.L2
!TP1_XTLK_DY: IC16.2(A:O) IC19.2(A:I1) M916_11.H2 M916_11.J2
!TS03: IC89.3(A:O) ; also sheet 2
!U+M_DY: IC108.1(A:I0) IC110.13(A:I2) ; also sheet 2
!USR_00: IC31.2(A:I0) IC56.13(A:!Q)
!USR_01: IC31.5(B:I0) IC56.8(B:!Q)
!USR_02: IC31.8(C:I0) IC57.13(A:!Q)
!UTS: IC67.9(B:I0) IC67.10(B:I1) IC67.12(B:I2) IC67.13(B:I3) IC109.11(C:I2) IC115.9(B:Q) IC119.1(A:I0) IC120.1(A:I0) IC120.2(A:I1) IC120.4(A:I2) IC120.5(A:I3)
!W-INH: IC7.9(B:Q) IC68.2(A:I1) IC70.10(B:I1)
!WB00: IC103.5(2D) IC114.5(A:Q) M916_5.P2 M916_12.P2
!WB01: IC105.10(1E) IC114.9(B:Q) M916_13.P2
!WB02: IC104.5(2D) IC115.5(A:Q) M916_4.P2
!WC: IC71.12(B:I2) IC110.3(B:I0) ; also sheet 2
!WC0: IC93.8(D:O) ; also sheet 2
!WR_EN: IC2.10(C:I1) IC106.9(C:I0) IC109.9(C:I0) IC116.5(A:Q) IC117.9(C:I0) IC118.1(A:I0)
!WRITE_ALL: IC125.6 IC126.5(C:I)
!WRITE_DATA: IC60.10(C:I1) IC125.5 IC126.3(B:I)
!WRITE_OK: IC11.13(D:I1) IC123.4(B:O)
!WRTM: IC60.1(A:I0) IC104.9(1D) IC125.7 IC126.9(D:I)
!XSAD: IC14.13(F:I) ; also sheet 2
!XSTA: IC61.2(A:I1) IC87.11(D:O) IC88.3(B:I) ; also sheet 2
+3V@A09U1: IC2.1(A:I0) IC2.2(A:I1) IC2.13(A:I2) IC4.6(C:O) IC5.4(A:PRE) IC5.10(B:PRE) IC6.13(B:CLR) IC7.1(A:CLR) IC7.13(B:CLR) IC75.4(A:PRE) IC75.10(B:PRE)
+3V@B12U1: IC55.10(E:O) IC73.4(A:PRE) IC73.10(B:PRE) IC74.4(A:PRE) IC76.1(A:CLR) IC76.10(B:PRE) IC76.13(B:CLR) IC77.1(A:CLR) IC77.4(A:PRE) IC77.10(B:PRE) IC77.13(B:CLR)
+3V@C08U1: IC79.1(A:I0) IC79.4(B:I0) IC79.9(C:I0) IC79.12(D:I0) IC80.1(A:I0) IC80.4(B:I0) IC80.9(C:I0) IC80.12(D:I0) IC81.1(A:I0) IC81.4(B:I0) IC81.9(C:I0) IC81.12(D:I0) IC82.1(A:I0) IC82.4(B:I0) IC82.9(C:I0) IC82.12(D:I0) IC86.11(I6) IC86.12(I7) IC87.2(A:I1) IC89.2(A:I1) IC89.5(B:I1) IC90.11(I6) IC90.12(I7) IC91.5(B:I1) IC94.8(D:O)
+3V@C15U1: IC113.4(B:O) IC114.1(A:CLR) IC114.4(A:PRE) IC114.10(B:PRE) IC114.13(B:CLR) IC115.1(A:CLR) IC115.4(A:PRE) IC115.13(B:CLR) IC116.1(A:CLR) IC121.5(A:I3)
+3V@D09U1: IC110.9(C:I0) IC110.10(C:I1) IC110.11(C:I2) IC126.12(F:O)
+3V@D10U1: IC116.10(B:PRE) IC134.6(I5) IC134.11(I6) IC134.12(I7) IC136.2(A:O) IC137.4(A:PRE) IC137.10(B:PRE) ; also sheet 2
-15V: M916_3.B2 M916_4.B2 M916_5.B2 M916_6.B2 M916_7.B2 M916_12.B2 M916_13.B2 M916_14.B2 M916_15.B2 M916_16.B2
ADDR_ACC: IC82.11(D:O) IC123.9(D:I)
B-BRK: IC67.1(A:I0) IC67.2(A:I1) IC67.4(A:I2) IC67.5(A:I3) IC79.6(B:O) ; also sheet 2
B-RUN: IC69.3(B:I0) IC79.3(A:O)
B-XSTA: IC11.10(C:I1) IC107.9(C:I0) ; also sheet 2
BAC_00: IC16.4(B:O) IC56.3(A:K) IC56.14(A:J)
BAC_01: IC16.8(D:O) IC56.7(B:J) IC56.10(B:K)
BAC_02: IC16.10(E:O) IC57.3(A:K) IC57.14(A:J)
BAC_03: IC54.2(A:O) IC57.7(B:J) IC57.10(B:K)
BAC_04: IC54.6(C:O) IC96.7(B:J) IC96.10(B:K)
BAC_05: IC54.10(E:O) IC58.3(A:K) IC58.14(A:J)
BAC_06: IC54.12(F:O) IC58.7(B:J) IC58.10(B:K) IC116.12(B:D)
BAC_07: IC55.4(B:O) IC95.3(A:K) IC95.14(A:J) IC137.2(A:D)
BAC_08: IC16.6(C:O) IC95.7(B:J) IC95.10(B:K) IC137.12(B:D)
BAC_09: IC16.12(F:O) IC96.3(A:K) IC96.14(A:J)
BAC_10: IC54.4(B:O)
BAC_11: IC54.8(D:O)
BLK_IN_SYNC: IC106.2(A:I1) IC112.8(D:O) M916_18.P2
BMB_00: IC88.12(F:O) IC97.3(2B)
BMB_01: IC92.4(B:O) IC99.12(1B)
BMB_02: IC92.6(C:O) IC98.3(2B)
BMB_03: IC92.10(E:O) IC97.12(1B)
BMB_04: IC93.2(A:O) IC98.12(1B)
BMB_05: IC93.6(C:O) IC99.3(2B)
BMB_06: IC59.2(A:I1) IC93.10(E:O)
BMB_07: IC59.5(B:I1) IC94.2(A:O)
BMB_08: IC59.10(C:I1) IC92.2(A:O)
BMB_09: IC60.5(B:I1) IC92.8(D:O)
BMB_10: IC60.13(D:I1) IC92.12(F:O)
BMB_11: IC59.13(D:I1) IC93.4(B:O)
BMB_TO_DTB: IC59.1(A:I0) IC59.4(B:I0) IC59.9(C:I0) IC59.12(D:I0) IC60.4(B:I0) IC60.12(D:I0) IC97.1(1A) IC97.2(2A) IC98.1(1A) IC98.2(2A) IC99.1(1A) IC99.2(2A) ; also sheet 2
BMR00: IC76.9(B:Q) M916_7.F1
BMR01: IC76.6(A:!Q) M916_7.B1
C00: IC18.1(A:I0) IC72.9(B:I0) IC75.5(A:Q) IC117.10(C:I1) IC133.3(I2) M916_10.E2
C01: IC18.2(A:I1) IC65.12(B:I2) IC69.11(C:I2) IC74.9(B:Q) M916_10.F2
CK00: IC77.5(A:Q) M916_3.P2
CK01: IC77.2(A:D) IC77.9(B:Q) IC120.10(B:I1) IC120.12(B:I2) IC120.13(B:I3)
COMP+SH: IC17.1(A:I0) IC114.3(A:CLK) IC114.11(B:CLK) IC115.3(A:CLK) IC117.11(D:O)
CSTA: IC88.2(A:O) ; also sheet 2
DATA: IC111.3(B:I) M916_10.M1 M916_17.K2
DF: IC13.1(A:I0) M916_10.E1 ; also sheet 2
DTB_00: IC100.5(A:Q) IC103.3(2B) IC130.1(1A) M916_9.A2
DTB_01: IC100.9(B:Q) IC105.12(1B) IC131.1(1A) M916_9.B2
DTB_02: IC101.5(A:Q) IC104.3(2B) IC132.2(2A) M916_9.C2
DTB_03: IC100.2(A:D) IC101.9(B:Q) M916_9.D2
DTB_04: IC100.12(B:D) IC102.5(A:Q) M916_9.E2
DTB_05: IC101.2(A:D) IC102.9(B:Q) M916_9.F2
DTB_06: IC62.5(A:Q) IC101.12(B:D) M916_9.H2
DTB_07: IC64.9(B:Q) IC102.2(A:D) M916_9.J2
DTB_08: IC63.5(A:Q) IC102.12(B:D) M916_9.K2
DTB_09: IC62.2(A:D) IC63.9(B:Q) M916_9.L2
DTB_10: IC64.5(A:Q) IC64.12(B:D) M916_9.M2
DTB_11: IC62.9(B:Q) IC63.2(A:D) M916_9.N2
DTF: IC6.2(A:D) IC17.13(D:I1) M916_10.C1 ; also sheet 2
DTSF: IC18.5(B:I1) IC88.6(C:O)
EF: IC13.11(D:O) IC14.5(C:I) IC17.12(D:I0) M916_9.N1
END: IC5.5(A:Q) M916_9.R1
ENI: IC17.4(B:I0) IC96.12(A:Q) M916_9.L1
FR_00: IC58.12(A:Q) IC71.10(B:I1) IC110.4(B:I1) M916_9.F1
FR_01: IC11.12(D:I0) IC58.9(B:Q) IC78.5(B:I1) IC117.4(B:I0) IC125.22(B) M916_9.H1 ; also sheet 2
FR_02: IC95.12(A:Q) IC125.21(C) M916_9.J1
FR_03: IC78.13(D:I1) IC95.9(B:Q) IC125.20(D) M916_9.K1
FR_03_: IC110.8(C:O) IC125.18(G1) IC125.19(G2)
GND: IC1.23(A) IC4.5(C:I) IC7.12(B:D) IC46.3(A:I1) IC46.6(B:I1) IC46.9(C:I1) IC46.12(D:I1) IC47.3(A:I1) IC47.6(B:I1) IC47.9(C:I1) IC47.12(D:I1) IC48.3(A:I1) IC55.9(D:I) IC55.11(E:I) IC94.9(D:I) IC113.3(B:I) IC125.23(A) IC126.13(F:I) IC136.1(A:I) M916_1.C2 M916_1.T1 M916_2.C2 M916_2.T1 M916_3.C2 M916_4.C2 M916_5.C2 M916_6.C2 M916_6.M2 M916_7.C1 M916_7.C2 M916_7.F2 M916_7.J1 M916_7.M2 M916_7.P1 M916_7.T1 M916_7.T2 M916_7.U1 M916_7.V1 M916_9.M1 M916_10.D2 M916_10.U2 M916_10.V1 M916_11.C2 M916_11.T1 M916_12.C2 M916_13.C2 M916_14.C2 M916_15.C2 M916_15.T1 M916_15.T2 M916_15.U1 M916_15.V1 M916_16.C2 M916_17.C2 M916_17.T1 M916_18.C2 M916_18.T1 SV1.A SV1.AA SV1.B SV1.C SV1.CC SV1.E SV1.EE SV1.H SV1.HH SV1.K SV1.KK SV1.M SV1.MM SV1.P SV1.PP SV1.S SV1.SS SV1.U SV1.UU SV1.VV SV1.W SV1.Y SV2.A SV2.AA SV2.B SV2.C SV2.CC SV2.E SV2.EE SV2.H SV2.HH SV2.K SV2.KK SV2.M SV2.MM SV2.P SV2.PP SV2.S SV2.SS SV2.U SV2.UU SV2.VV SV2.W SV2.Y SV3.A SV3.AA SV3.B SV3.C SV3.CC SV3.E SV3.EE SV3.H SV3.HH SV3.K SV3.KK SV3.M SV3.MM SV3.P SV3.PP SV3.S SV3.SS SV3.U SV3.UU SV3.VV SV3.W SV3.Y SV4.A SV4.AA SV4.B SV4.BB SV4.C SV4.CC SV4.D SV4.E SV4.EE SV4.F SV4.FF SV4.H SV4.HH SV4.J SV4.K SV4.KK SV4.LL SV4.M SV4.MM SV4.N SV4.P SV4.PP SV4.RR SV4.S SV4.SS SV4.T SV4.U SV4.UU SV4.VV SV4.W SV4.X SV4.Y SV5.A SV5.AA SV5.B SV5.C SV5.CC SV5.E SV5.EE SV5.H SV5.HH SV5.K SV5.KK SV5.M SV5.MM SV5.P SV5.PP SV5.S SV5.SS SV5.U SV5.UU SV5.V SV5.VV SV5.W SV5.Y SV6.1 SV6.3 SV6.5 SV6.7 SV6.8 SV6.9 SV6.10 SV6.11 SV6.13 SV6.15 SV6.17 SV6.18 SV6.19 SV6.20 SV6.21 SV6.23 SV6.25 SV6.27 SV6.29 SV6.31 SV6.33 SV7.1 SV7.3 SV7.5 SV7.7 SV7.9 SV7.11 SV7.13 SV7.14 SV7.15 SV7.16 SV7.17 SV7.19 SV7.21 SV7.23 SV7.25 SV7.26 SV7.27 SV7.28 SV7.29 SV7.30 SV7.31 SV7.33 SV7.34 SV8.A SV8.AA SV8.B SV8.C SV8.CC SV8.E SV8.EE SV8.H SV8.HH SV8.K SV8.KK SV8.M SV8.MM SV8.P SV8.PP SV8.S SV8.SS SV8.U SV8.UU SV8.VV SV8.W SV8.Y SV9.A SV9.AA SV9.B SV9.C SV9.CC SV9.E SV9.EE SV9.H SV9.HH SV9.K SV9.KK SV9.M SV9.MM SV9.P SV9.PP SV9.S SV9.SS SV9.U SV9.UU SV9.VV SV9.W SV9.Y SV10.A SV10.AA SV10.B SV10.C SV10.CC SV10.E SV10.EE SV10.H SV10.HH SV10.K SV10.KK SV10.M SV10.MM SV10.P SV10.PP SV10.S SV10.SS SV10.U SV10.UU SV10.VV SV10.W SV10.Y SV11.A SV11.AA SV11.B SV11.BB SV11.C SV11.CC SV11.D SV11.E SV11.EE SV11.F SV11.FF SV11.H SV11.HH SV11.J SV11.K SV11.KK SV11.LL SV11.M SV11.MM SV11.N SV11.P SV11.PP SV11.RR SV11.S SV11.SS SV11.T SV11.U SV11.UU SV11.VV SV11.W SV11.X SV11.Y SV12.A SV12.AA SV12.B SV12.C SV12.CC SV12.E SV12.EE SV12.H SV12.HH SV12.K SV12.KK SV12.M SV12.MM SV12.P SV12.PP SV12.S SV12.SS SV12.U SV12.UU SV12.V SV12.VV SV12.W SV12.Y ; also sheet 2
I/!O_0_TO_AC: IC50.5(B:O) SV3.DD SV10.DD
I/!O_0_TO_AC_B05: IC46.13(D:O) IC50.6(B:I0) IC50.7(B:I1)
I/!O_1_TO_CA_INH: IC53.3(A:O) SV5.Z SV12.Z
I/!O_1_TO_CA_INH_B05: IC48.1(A:O) IC53.1(A:I0) IC53.2(A:I1)
I/!O_ADDR_ACC: IC82.13(D:I1) SV4.JJ SV11.JJ
I/!O_BMB_03: SV2.T SV9.T
I/!O_BMB_04: SV2.BB SV9.BB
I/!O_BMB_05: SV2.LL SV9.LL
I/!O_BMB_06: SV2.F SV9.F
I/!O_BMB_07: SV2.R SV9.R
I/!O_BMB_08: IC86.6(I5) SV2.Z SV9.Z
I/!O_BRK_RQ: IC49.3(A:O) SV4.V SV11.V
I/!O_BRK_RQ_B05: IC46.1(A:O) IC49.1(A:I0) IC49.2(A:I1)
I/!O_BWC0: IC79.10(C:I1) SV5.DD SV12.DD
I/!O_INT_RQ: IC49.5(B:O) SV3.Z SV10.Z
I/!O_INT_RQ_B05: IC46.4(B:O) IC49.6(B:I0) IC49.7(B:I1)
I/!O_SKP_RQ: IC50.3(A:O) SV3.V SV10.V
I/!O_SKP_RQ_B05: IC46.10(C:O) IC50.1(A:I0) IC50.2(A:I1)
I/O_B-BRK: IC79.5(B:I1) SV4.DD SV11.DD
I/O_B-RUN: IC79.2(A:I1) SV3.JJ SV10.JJ
I/O_BAC_00: IC83.2(A:I1) SV1.D SV8.D
I/O_BAC_01: IC83.5(B:I1) SV1.J SV8.J
I/O_BAC_02: IC85.10(C:I1) SV1.N SV8.N
I/O_BAC_03: IC84.10(C:I1) SV1.T SV8.T
I/O_BAC_04: IC84.13(D:I1) SV1.X SV8.X
I/O_BAC_05: IC85.2(A:I1) SV1.BB SV8.BB
I/O_BAC_06: IC85.5(B:I1) SV1.FF SV8.FF
I/O_BAC_07: IC84.5(B:I1) SV1.LL SV8.LL
I/O_BAC_08: IC83.10(C:I1) SV1.RR SV8.RR
I/O_BAC_09: IC83.13(D:I1) SV1.F SV8.F
I/O_BAC_10: IC84.2(A:I1) SV1.L SV8.L
I/O_BAC_11: IC85.13(D:I1) SV1.R SV8.R
I/O_BMB_00: IC79.13(D:I1) SV2.D SV9.D
I/O_BMB_01: IC80.2(A:I1) SV2.J SV9.J
I/O_BMB_02: IC82.5(B:I1) SV2.N SV9.N
I/O_BMB_03: IC81.5(B:I1) IC86.1(I0) IC90.1(I0) SV2.X SV9.X
I/O_BMB_04: IC81.10(C:I1) IC86.2(I1) IC90.2(I1) SV2.FF SV9.FF
I/O_BMB_05: IC81.13(D:I1) IC86.3(I2) IC90.3(I2) SV2.RR SV9.RR
I/O_BMB_06: IC82.2(A:I1) IC86.4(I3) IC90.4(I3) SV2.L SV9.L
I/O_BMB_07: IC81.2(A:I1) IC86.5(I4) IC90.5(I4) SV2.V SV9.V
I/O_BMB_08: IC80.5(B:I1) IC90.6(I5) SV2.DD SV9.DD
I/O_BMB_09: IC80.10(C:I1) SV2.JJ SV9.JJ
I/O_BMB_10: IC80.13(D:I1) SV2.NN SV9.NN
I/O_BMB_11: IC82.10(C:I1) SV2.TT SV9.TT
I/O_DATA_IN: IC52.5(B:O) SV4.Z SV11.Z
I/O_DATA_IN_B05: IC47.13(D:O) IC52.6(B:I0) IC52.7(B:I1)
I/O_PWR_CLR: IC91.4(B:I0) SV1.TT SV8.TT
I/O_TS03: IC89.1(A:I0) SV1.JJ SV8.JJ
I/O_TS04: SV1.NN SV8.NN
IOP_1: IC87.5(B:I1) IC89.10(C:I1) SV1.V SV8.V
IOP_2: IC87.10(C:I1) IC89.13(D:I1) SV1.Z SV8.Z
IOP_4: IC87.13(D:I1) IC91.2(A:I1) SV1.DD SV8.DD
LDMF: IC88.10(E:O) IC116.11(B:CLK) IC137.3(A:CLK) IC137.11(B:CLK)
LPB_00: IC97.5(2D) IC127.12(A:Q) M916_9.T2
LPB_01: IC99.10(1E) IC128.12(A:Q) M916_9.U2
LPB_02: IC98.5(2D) IC129.12(A:Q) M916_9.V2
LPB_03: IC97.10(1E) IC127.9(B:Q) M916_10.A2
LPB_04: IC98.10(1E) IC128.9(B:Q) M916_10.B2
LPB_05: IC99.5(2D) IC129.9(B:Q) M916_10.C2
LPB_NOT_EQ_1: IC12.5(B:I1) IC135.8(O)
LPB_TO_DTB: IC15.12(F:O) IC97.4(2C) IC97.9(1D) IC98.4(2C) IC98.9(1D) IC99.4(2C) IC99.9(1D)
MC00: IC73.5(A:Q) IC73.12(B:D) IC133.5(I4) M916_10.S1
MC01: IC6.11(B:CLK) IC73.9(B:Q) IC74.2(A:D) IC91.13(D:I1) M916_10.T1
MC02: IC69.10(C:I1) IC74.5(A:Q) M916_10.U1 ; also sheet 2
MF00: IC116.9(B:Q) M916_9.V1
MF01: IC137.5(A:Q) M916_10.A1
MF02: IC137.9(B:Q) M916_10.B1
MK_BLK_END: IC10.12(B:I2) M916_17.U1
MK_BLK_MK: IC133.1(I0) IC133.2(I1) M916_18.E2
MK_BLK_START: M916_18.J2
MK_BLK_SYNC: M916_17.S2
MK_DATA: M916_17.P2
MK_DATA_SYNC: M916_18.H1
MK_END: IC5.2(A:D) M916_18.F2
MKT: IC72.10(B:I1) IC75.9(B:Q) IC78.4(B:I0) IC118.9(C:I0) M916_10.H2
MKTK: IC6.8(B:!Q) M916_9.P1
MOVE: IC124.8(D:O)
MR00: IC57.9(B:Q) IC76.12(B:D) M916_9.D1
MR01: IC96.9(B:Q) IC108.2(A:I1) M916_9.E1
N$1: IC55.5(C:I) IC61.3(A:O)
N$2: IC113.6(C:O) IC121.9(B:I0) IC121.10(B:I1) IC121.12(B:I2) IC121.13(B:I3)
N$3: IC15.5(C:I) IC69.6(B:O)
N$5: IC122.6(A:O) M916_2.H2
N$7: IC17.5(B:I1) IC17.11(D:O) IC18.4(B:I0)
N$8: IC123.13(F:I) ; also sheet 2
N$10: IC71.1(A:I0) IC91.8(C:O)
N$11: IC71.5(A:I3) IC91.11(D:O)
N$13: IC61.8(C:O) M916_1.H2 M916_1.J2 M916_1.K2
N$14: M916_2.D2 M916_2.E2
N$15: IC113.9(D:I) M916_2.F2
N$16: IC19.4(A:I2) IC19.5(A:I3) IC113.8(D:O)
N$17: IC77.3(A:CLK) IC77.11(B:CLK) ; also sheet 2
N$18: IC61.11(D:O) M916_1.M2 M916_1.N2 M916_1.P2
N$19: M916_1.H1 M916_1.L2
N$20: M916_2.R2 M916_2.S2
N$21: M916_1.D2 M916_1.E2
N$22: IC16.1(A:I) M916_1.T2
N$23: IC15.9(D:I) M916_1.F2
N$24: IC120.8(B:O) M916_11.K2
N$25: M916_1.R2 M916_1.V2
N$26: M916_1.S1 M916_1.S2
N$28: IC72.2(A:I1) IC109.12(A:O)
N$29: M916_11.D2 M916_11.E2
N$30: IC113.13(F:I) M916_11.F2
N$31: IC20.9(B:I0) IC20.10(B:I1) IC113.12(F:O)
N$32: IC78.8(C:O) IC123.5(C:I)
N$33: IC7.10(B:PRE) IC66.6(A:O)
N$34: IC124.5(C:I) ; also sheet 2
N$35: IC8.9(B:I0) IC104.8(1Y)
N$36: IC94.12(F:O) IC116.2(A:D)
N$37: M916_11.R2 M916_11.S2
N$38: IC117.3(A:O) IC117.12(D:I0)
N$39: IC117.6(B:O) IC117.13(D:I1)
N$42: IC106.6(B:O) IC106.12(D:I0)
N$43: IC18.3(A:O) IC18.12(D:I0)
N$44: IC72.13(B:I3) IC106.11(D:O)
N$45: IC18.8(C:O) IC18.13(D:I1)
N$46: IC8.12(B:I2) IC11.11(D:O)
N$47: IC68.8(C:O) IC94.13(F:I)
N$48: IC71.6(A:O) IC107.4(B:I0)
N$49: IC68.10(C:I1) IC70.8(B:O)
N$50: IC110.12(A:O) IC118.12(D:I0)
N$51: IC72.8(B:O) IC108.4(B:I1)
N$52: IC107.6(B:O) IC108.3(B:I0)
N$53: IC118.6(B:O) IC118.13(D:I1)
N$54: IC106.3(A:O) IC108.5(B:I2)
N$55: IC68.9(C:I0) IC70.6(A:O)
N$56: IC2.6(B:O) IC68.11(C:I2)
N$58: IC15.11(E:I) IC61.6(B:O)
N$59: IC107.11(D:O) IC112.13(F:I)
N$60: IC72.1(A:I0) IC108.8(C:O)
N$61: IC72.4(A:I2) IC110.6(B:O)
N$62: IC71.8(B:O) IC72.5(A:I3)
N$63: IC74.10(B:PRE) IC78.3(A:O)
N$64: IC17.8(C:O) IC65.4(A:I2) IC65.5(A:I3)
N$65: IC107.8(C:O) IC107.12(D:I0)
N$66: IC17.3(A:O) IC65.1(A:I0) IC65.2(A:I1)
N$67: IC134.8(O) ; also sheet 2
N$70: IC2.9(C:I0) IC68.6(B:O)
N$71: IC78.6(B:O) IC113.11(E:I)
N$72: IC2.11(C:I2) IC68.12(A:O)
N$73: IC60.6(B:O) IC63.10(B:PRE)
N$76: IC115.11(B:CLK) IC119.3(A:O)
N$77: IC2.8(C:O) IC65.9(B:I0)
N$78: IC65.13(B:I3) IC113.10(E:O)
N$79: IC112.6(C:O) IC115.10(B:PRE)
N$80: IC8.13(B:I3) M916_14.U2
N$81: IC108.12(A:O) IC112.5(C:I)
N$82: IC69.8(C:O) IC123.1(A:I)
N$83: IC5.12(B:D) IC8.8(B:O)
N$84: IC11.3(A:O) IC11.4(B:I0)
N$85: IC11.2(A:I1) IC11.6(B:O) IC78.12(D:I0)
N$86: IC69.13(A:I2) IC78.11(D:O)
N$91: IC60.11(D:O) IC64.4(A:PRE)
N$92: IC59.11(D:O) IC62.10(B:PRE)
N$93: IC127.3(A:K) IC127.14(A:J) IC130.6(2Y)
N$94: IC127.7(B:J) IC127.10(B:K) IC130.8(1Y)
N$95: IC128.3(A:K) IC128.14(A:J) IC132.8(1Y)
N$96: IC129.3(A:K) IC129.14(A:J) IC131.6(2Y)
N$97: IC59.3(A:O) IC62.4(A:PRE)
N$99: IC129.7(B:J) IC129.10(B:K) IC132.6(2Y)
N$100: IC128.7(B:J) IC128.10(B:K) IC131.8(1Y)
N$101: IC124.4(B:O) IC127.5(B:CLK) IC128.5(B:CLK) IC129.5(B:CLK)
N$103: IC123.10(E:O) IC127.1(A:CLK) IC128.1(A:CLK) IC129.1(A:CLK)
N$104: IC97.8(1Y) IC101.10(B:PRE)
N$105: IC4.9(D:I) IC8.6(A:O)
N$106: IC4.8(D:O) IC9.13(B:I3)
N$107: IC6.12(B:D) IC9.8(B:O)
N$108: IC103.8(1Y) IC123.11(E:I)
N$109: IC105.6(2Y) IC124.3(B:I)
N$111: IC10.13(B:I3) IC124.2(A:O)
N$112: IC59.6(B:O) IC64.10(B:PRE)
N$113: IC59.8(C:O) IC63.4(A:PRE)
N$114: IC10.8(B:O) IC15.13(F:I)
N$115: IC118.8(C:O) IC124.1(A:I)
N$116: IC113.1(A:I) IC118.3(A:O)
N$117: IC109.6(B:O) ; also sheet 2
N$118: IC106.8(C:O) ; also sheet 2
N$119: IC112.11(E:I) IC117.8(C:O)
N$123: M916_3.D2 M916_3.J2 SV7.10
N$124: IC4.11(E:I) IC12.11(D:O)
N$125: IC7.2(A:D) IC12.6(B:O)
N$126: M916_3.E2 M916_3.K2 SV7.12
N$127: M916_12.D2 M916_12.J2 SV7.22
N$128: IC4.10(E:O) IC7.3(A:CLK)
N$129: IC99.6(2Y) IC102.10(B:PRE)
N$130: M916_12.E2 M916_12.K2 SV7.24
N$131: M916_4.D2 M916_4.J2 SV7.32
N$132: IC4.12(F:O) IC6.4(A:PRE)
N$133: M916_4.E2 M916_4.K2 SV6.6
N$134: M916_13.D2 M916_13.J2 SV6.12
N$135: M916_13.E2 M916_13.K2 SV6.14
N$136: M916_5.D2 M916_5.J2 SV6.22
N$137: IC4.13(F:I) IC13.6(B:O)
N$138: IC9.6(A:O) IC13.5(B:I1)
N$139: IC13.3(A:O) IC13.4(B:I0)
N$140: M916_5.E2 M916_5.K2 SV6.24
N$142: IC98.8(1Y) IC102.4(A:PRE)
N$146: IC97.6(2Y) IC100.4(A:PRE)
N$147: IC99.8(1Y) IC100.10(B:PRE)
N$148: IC98.6(2Y) IC101.4(A:PRE)
N$153: IC11.8(C:O) IC12.2(A:I1)
N$155: IC105.8(1Y) IC114.12(B:D)
N$161: IC10.6(A:O) IC14.1(A:I)
N$162: IC13.10(C:I1) IC13.12(D:I0) IC14.2(A:O)
N$185: IC103.6(2Y) IC114.2(A:D)
N$193: IC104.6(2Y) IC115.2(A:D)
PAR: IC7.6(A:!Q) M916_9.T1
PC+ES: IC13.8(C:O) IC14.9(D:I)
PWR_CLR: IC93.12(F:O)
RD+WD: IC9.4(A:I2) IC60.8(C:O) IC71.9(B:I0) IC109.2(A:I1)
RD_EN: IC106.5(B:I1) IC107.3(A:O)
RD_EN_LPB_00-02: IC103.1(1A) IC113.2(A:O) IC130.5(2D) IC131.5(2D) IC132.10(1E)
RD_EN_LPB_03-05: IC105.2(2A) IC112.10(E:O) IC130.10(1E) IC131.10(1E) IC132.5(2D)
RDD_00: IC63.12(B:D) IC130.4(2C) IC130.9(1D) M916_5.U2
RDD_01: IC64.2(A:D) IC131.9(1D) IC132.9(1D) M916_13.U2
RDD_02: IC62.12(B:D) IC131.4(2C) IC132.4(2C) M916_4.U2
RDMK: M916_12.U2 M916_18.S2
READ_ALL: IC126.2(A:O)
READ_DATA: IC12.4(B:I0) IC106.4(B:I0) IC124.12(F:O)
RSTA: IC55.12(F:O)
RSTB: IC88.8(D:O)
SE: IC126.10(E:O)
SEARCH: IC106.1(A:I0) IC124.10(E:O)
SEL: IC5.9(B:Q) M916_9.S1
SH_DTB: IC13.2(A:I1) IC62.3(A:CLK) IC62.11(B:CLK) IC63.3(A:CLK) IC63.11(B:CLK) IC64.3(A:CLK) IC64.11(B:CLK) IC65.6(A:O) IC100.3(A:CLK) IC100.11(B:CLK) IC101.3(A:CLK) IC101.11(B:CLK) IC102.3(A:CLK) IC102.11(B:CLK)
SH_EN: IC15.4(B:O) IC17.2(A:I1) IC103.2(2A) IC104.2(2A) IC105.1(1A)
SH_ST: IC113.5(C:I) M916_18.M1
SH_ST-B: IC121.8(B:O) M916_17.C1
SHIFT_CK: IC123.2(A:O) M916_17.R2
ST_BLK_MK: IC111.5(C:I) M916_10.K1 M916_18.R2
ST_CK: IC12.12(D:I0) IC111.9(D:I) M916_10.P1 M916_17.R1 ; also sheet 2
ST_CK_0P: IC71.13(B:I3) IC94.10(E:O) IC109.13(A:I2)
ST_DATA: IC70.1(A:I0) IC111.11(E:I) IC121.6(A:O)
ST_FINAL: IC10.10(B:I1) IC91.12(D:I0) IC111.13(F:I) M916_10.N1 M916_17.L2
ST_IDLE: IC112.1(A:I) M916_10.R1 M916_17.D2
ST_REV_CK: IC68.5(B:I2) IC91.9(C:I0) IC111.1(A:I) M916_10.L1 M916_17.S1 ; also sheet 2
SWTM: IC2.4(B:I1) IC55.1(A:I) IC55.8(D:O) IC104.10(1E) IC110.2(A:I1) IC118.4(B:I0) M916_10.V2
SYNC: IC66.9(B:I0) IC66.10(B:I1) M916_17.N2
SYNC_EN: IC69.12(A:O) M916_17.H1
T3: IC123.12(F:O) ; also sheet 2
T_TRK: IC61.13(D:I1) IC119.2(A:I1) M916_3.U2 ; also sheet 2
TIM: IC6.5(A:Q) M916_9.U1
TM_EN: IC112.3(B:I) IC118.11(D:O) IC120.9(B:I0) IC122.1(A:I0) M916_3.R2 M916_12.R2
TP00: IC5.3(A:CLK) IC19.8(B:O) IC66.2(A:I1) IC66.12(B:I2) IC66.13(B:I3) IC73.3(A:CLK) IC73.11(B:CLK) IC74.3(A:CLK) IC78.2(A:I1) IC117.5(B:I1) M916_2.M2 M916_2.N2 M916_2.P2
TP00_A: IC20.6(A:O) IC65.10(B:I1) IC109.4(B:I1)
TP01: IC17.10(C:I1) IC21.6(A:O) IC106.10(C:I1) IC117.2(A:I1) M916_11.M2 M916_11.N2 M916_11.P2 M916_17.F1
TP01_A: IC21.8(B:O) IC72.12(B:I2) IC118.10(C:I1)
USR_00: IC1.22(B) IC56.12(A:Q) M916_9.A1
USR_01: IC1.21(C) IC56.9(B:Q) M916_9.B1
USR_02: IC1.20(D) IC57.12(A:Q) M916_9.C1
USR_02_: IC1.18(G1) IC1.19(G2) IC2.12(A:O)
UTS: IC11.5(B:I1) IC78.9(C:I0) IC115.8(B:!Q) M916_10.J1
VCC: IC97.11(1F) IC97.13(1C) IC98.11(1F) IC98.13(1C) IC99.11(1F) IC99.13(1C) IC103.11(1F) IC103.13(1C) IC104.11(1F) IC104.13(1C) IC105.11(1F) IC105.13(1C) IC130.11(1F) IC130.13(1C) IC131.11(1F) IC131.13(1C) IC132.11(1F) IC132.13(1C) M916_1.A2 M916_2.A2 M916_3.A2 M916_4.A2 M916_5.A2 M916_6.A2 M916_7.A2 M916_11.A2 M916_12.A2 M916_13.A2 M916_14.A2 M916_15.A2 M916_17.A2 M916_18.A2 ; also sheet 2
W01: M916_10.J2 M916_17.J2
W01-W05: M916_18.K1
W02: M916_10.K2 M916_17.V2
W03: M916_10.L2 M916_17.E2
W04: M916_10.M2 M916_18.T2
W05: M916_10.N2 M916_17.U2
W06: M916_10.P2 M916_18.M2
W07: M916_10.R2 M916_18.K2
W08: M916_10.S2 M916_18.L1
W09: M916_10.T2 M916_17.F2
W+UTS: IC19.1(A:I0) IC20.13(B:I3) IC109.8(C:O)
W-INH: IC7.8(B:!Q)
WB00: IC114.6(A:!Q) IC130.2(2A) M916_5.N2 M916_9.P2 M916_12.N2
WB01: IC114.8(B:!Q) IC132.1(1A) M916_9.R2 M916_13.N2
WB02: IC115.6(A:!Q) IC131.2(2A) M916_4.N2 M916_9.S2
WC: IC66.1(A:I0) IC68.1(A:I0) M916_10.H1 ; also sheet 2
WC0: IC79.8(C:O) IC93.9(D:I)
WR_EN: IC103.10(1E) IC105.5(2D) IC109.3(B:I0) IC116.6(A:!Q) IC117.1(A:I0) IC118.5(B:I1) IC130.3(2B) IC130.12(1B) IC131.3(2B) IC131.12(1B) IC132.3(2B) IC132.12(1B) M916_4.R2 M916_5.R2 M916_10.F1 M916_13.R2
WRITE_ALL: IC7.11(B:CLK) IC68.13(A:I2) IC70.9(B:I0) IC126.6(C:O)
WRITE_DATA: IC10.9(B:I0) IC68.4(B:I1) IC70.2(A:I1) IC71.4(A:I2) IC126.4(B:O)
WRITE_OK: IC2.5(B:I2) IC78.10(C:I1) IC123.3(B:I) M916_6.D2
WRITE_OK+UTS: IC70.5(A:I3) IC70.13(B:I3) IC123.6(C:O)
WRTM: IC2.3(B:I0) IC104.1(1A) IC110.1(A:I0) IC126.8(D:O)
WRTM+FR03: IC60.3(A:O) IC108.11(C:I2) IC110.5(B:I2)
XOR_TO_LPB: IC103.9(1D) IC103.12(1B) IC105.3(2B) IC105.4(2C) ; also sheet 2
XSA_DY: IC5.11(B:CLK) IC76.3(A:CLK) IC76.11(B:CLK) IC124.6(C:O)
XSAD: IC9.5(A:I3) IC14.12(F:O)
XSTA: IC56.1(A:CLK) IC56.5(B:CLK) IC57.1(A:CLK) IC57.5(B:CLK) IC58.1(A:CLK) IC58.5(B:CLK) IC88.4(B:O) IC95.1(A:CLK) IC95.5(B:CLK) IC96.1(A:CLK) IC96.5(B:CLK) ; also sheet 2
Unconnected: IC1.9 IC1.10 IC1.11 IC1.13 IC1.14 IC1.15 IC1.16 IC1.17 IC48.4(B:O) IC48.5(B:I0) IC48.6(B:I1) IC48.8(C:I0) IC48.9(C:I1) IC48.10(C:O) IC48.11(D:I0) IC48.12(D:I1) IC48.13(D:O) IC53.5(B:O) IC53.6(B:I0) IC53.7(B:I1) IC119.4(B:I0) IC119.5(B:I1) IC119.6(B:O) IC119.8(C:O) IC119.9(C:I0) IC119.10(C:I1) IC119.11(D:O) IC119.12(D:I0) IC119.13(D:I1) IC122.8(B:O) IC122.9(B:I0) IC122.10(B:I1) IC122.12(B:I2) IC122.13(B:I3) IC125.9 IC125.10 IC125.11 IC125.13 IC125.14 IC125.15 IC125.16 IC125.17 IC136.3(B:I) IC136.4(B:O) IC136.5(C:I) IC136.6(C:O) IC136.8(D:O) IC136.9(D:I) IC136.10(E:O) IC136.11(E:I) IC136.12(F:O) IC136.13(F:I) M916_1.A1 M916_1.B1 M916_1.B2 M916_1.C1 M916_1.D1 M916_1.E1 M916_1.F1 M916_1.J1 M916_1.K1 M916_1.L1 M916_1.M1 M916_1.N1 M916_1.P1 M916_1.R1 M916_1.U1 M916_1.U2 M916_1.V1 M916_2.A1 M916_2.B1 M916_2.B2 M916_2.C1 M916_2.D1 M916_2.E1 M916_2.F1 M916_2.H1 M916_2.J1 M916_2.K1 M916_2.L1 M916_2.M1 M916_2.N1 M916_2.P1 M916_2.R1 M916_2.S1 M916_2.T2 M916_2.U1 M916_2.U2 M916_2.V1 M916_2.V2 M916_3.A1 M916_3.B1 M916_3.C1 M916_3.D1 M916_3.E1 M916_3.F1 M916_3.F2 M916_3.H1 M916_3.H2 M916_3.J1 M916_3.K1 M916_3.L1 M916_3.L2 M916_3.M1 M916_3.M2 M916_3.N1 M916_3.P1 M916_3.R1 M916_3.S1 M916_3.S2 M916_3.T1 M916_3.T2 M916_3.U1 M916_3.V1 M916_4.A1 M916_4.B1 M916_4.C1 M916_4.D1 M916_4.E1 M916_4.F1 M916_4.F2 M916_4.H1 M916_4.H2 M916_4.J1 M916_4.K1 M916_4.L1 M916_4.L2 M916_4.M1 M916_4.M2 M916_4.N1 M916_4.P1 M916_4.R1 M916_4.S1 M916_4.S2 M916_4.T1 M916_4.T2 M916_4.U1 M916_4.V1 M916_5.A1 M916_5.B1 M916_5.C1 M916_5.D1 M916_5.E1 M916_5.F1 M916_5.F2 M916_5.H1 M916_5.H2 M916_5.J1 M916_5.K1 M916_5.L1 M916_5.L2 M916_5.M1 M916_5.M2 M916_5.N1 M916_5.P1 M916_5.R1 M916_5.S1 M916_5.S2 M916_5.T1 M916_5.T2 M916_5.U1 M916_5.V1 M916_6.A1 M916_6.B1 M916_6.C1 M916_6.D1 M916_6.E1 M916_6.E2 M916_6.F1 M916_6.F2 M916_6.H1 M916_6.J1 M916_6.J2 M916_6.K1 M916_6.K2 M916_6.L1 M916_6.L2 M916_6.M1 M916_6.N1 M916_6.N2 M916_6.P1 M916_6.P2 M916_6.R1 M916_6.R2 M916_6.S1 M916_6.S2 M916_6.T1 M916_6.T2 M916_6.U1 M916_6.U2 M916_6.V1 M916_6.V2 M916_8.A1 M916_8.A2 M916_8.B1 M916_8.B2 M916_8.C1 M916_8.D1 M916_8.E1 M916_8.F1 M916_8.H1 M916_8.J1 M916_8.J2 M916_8.K1 M916_8.L1 M916_8.M1 M916_8.N1 M916_8.P1 M916_8.R1 M916_8.S1 M916_8.T1 M916_8.U1 M916_8.V1 M916_10.D1 M916_11.A1 M916_11.B1 M916_11.B2 M916_11.C1 M916_11.D1 M916_11.E1 M916_11.F1 M916_11.H1 M916_11.J1 M916_11.K1 M916_11.L1 M916_11.M1 M916_11.N1 M916_11.P1 M916_11.R1 M916_11.S1 M916_11.T2 M916_11.U1 M916_11.U2 M916_11.V1 M916_11.V2 M916_12.A1 M916_12.B1 M916_12.C1 M916_12.D1 M916_12.E1 M916_12.F1 M916_12.F2 M916_12.H1 M916_12.H2 M916_12.J1 M916_12.K1 M916_12.L1 M916_12.L2 M916_12.M1 M916_12.M2 M916_12.N1 M916_12.P1 M916_12.R1 M916_12.S1 M916_12.S2 M916_12.T1 M916_12.T2 M916_12.U1 M916_12.V1 M916_13.A1 M916_13.B1 M916_13.C1 M916_13.D1 M916_13.E1 M916_13.F1 M916_13.F2 M916_13.H1 M916_13.H2 M916_13.J1 M916_13.K1 M916_13.L1 M916_13.L2 M916_13.M1 M916_13.M2 M916_13.N1 M916_13.P1 M916_13.R1 M916_13.S1 M916_13.S2 M916_13.T1 M916_13.T2 M916_13.U1 M916_13.V1 M916_14.A1 M916_14.B1 M916_14.C1 M916_14.D1 M916_14.D2 M916_14.E1 M916_14.E2 M916_14.F1 M916_14.F2 M916_14.H1 M916_14.H2 M916_14.J1 M916_14.J2 M916_14.K1 M916_14.K2 M916_14.L1 M916_14.L2 M916_14.M1 M916_14.M2 M916_14.N1 M916_14.N2 M916_14.P1 M916_14.P2 M916_14.R1 M916_14.R2 M916_14.S1 M916_14.S2 M916_14.T1 M916_14.U1 M916_14.V1 M916_14.V2 M916_15.A1 M916_15.B1 M916_15.C1 M916_15.D1 M916_15.D2 M916_15.E1 M916_15.E2 M916_15.F1 M916_15.F2 M916_15.H1 M916_15.H2 M916_15.J1 M916_15.J2 M916_15.K1 M916_15.K2 M916_15.L1 M916_15.L2 M916_15.M1 M916_15.M2 M916_15.N1 M916_15.N2 M916_15.P1 M916_15.P2 M916_15.R1 M916_15.R2 M916_15.S1 M916_15.U2 M916_16.A1 M916_16.A2 M916_16.B1 M916_16.C1 M916_16.D1 M916_16.E1 M916_16.F1 M916_16.F2 M916_16.H1 M916_16.J1 M916_16.K1 M916_16.L1 M916_16.M1 M916_16.N1 M916_16.P1 M916_16.R1 M916_16.S1 M916_16.T1 M916_16.U1 M916_16.V1 M916_17.A1 M916_17.B1 M916_17.B2 M916_17.D1 M916_17.E1 M916_17.J1 M916_17.K1 M916_17.L1 M916_17.M1 M916_17.N1 M916_17.P1 M916_18.A1 M916_18.B1 M916_18.B2 M916_18.C1 M916_18.D1 M916_18.E1 M916_18.L2 M916_18.N2 M916_18.P1 M916_18.R1 M916_18.S1 M916_18.U1 M916_18.V1 SV3.NN SV3.TT SV4.L SV4.NN SV4.R SV4.TT SV6.2 SV6.4 SV6.16 SV6.26 SV6.28 SV6.30 SV6.32 SV6.34 SV7.2 SV7.4 SV7.6 SV7.8 SV7.18 SV7.20 SV10.NN SV10.TT SV11.L SV11.NN SV11.R SV11.TT

## Sheet 2 of 2
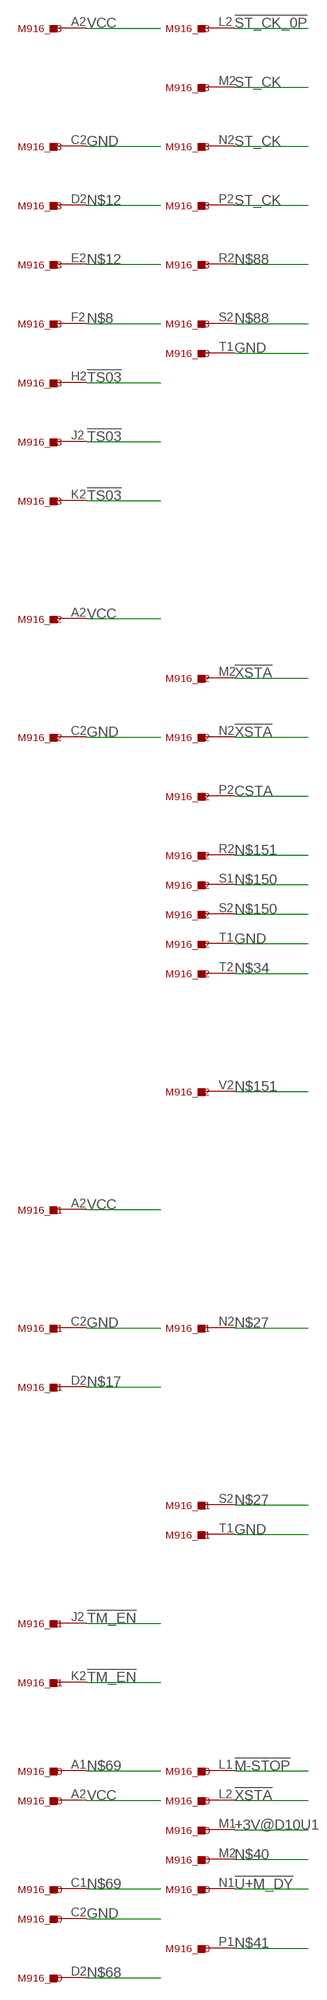
[diagram p5: schematic, sheet 2, part 1 of 2]
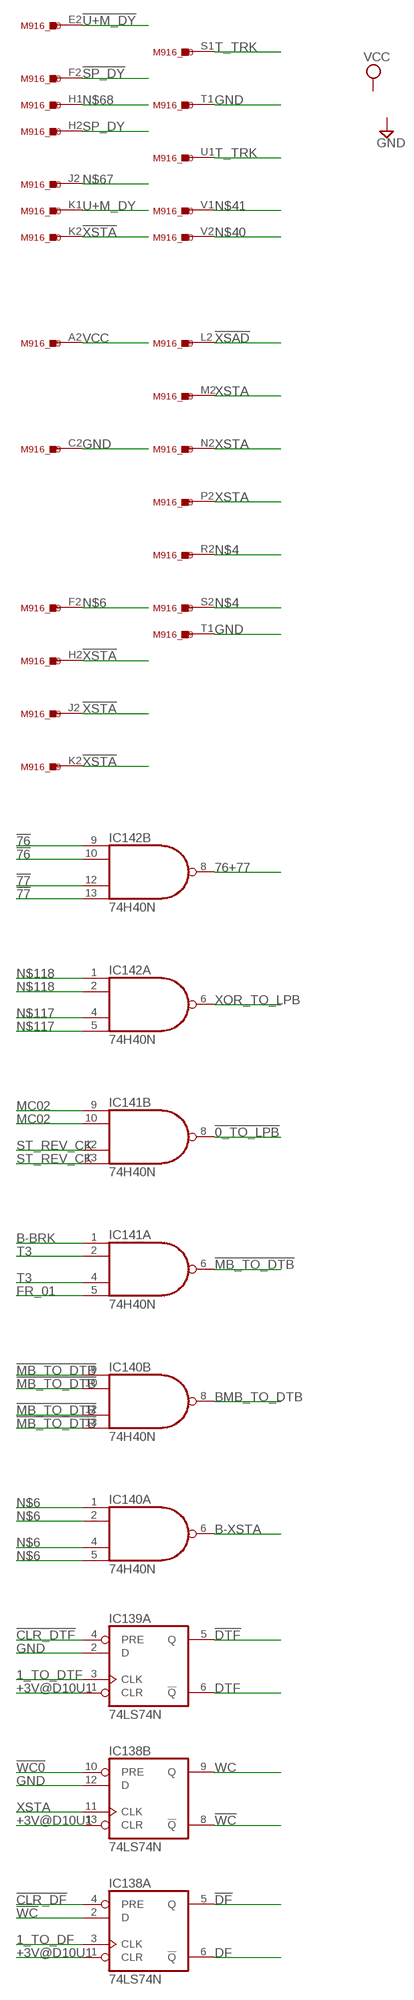
[diagram p6: schematic, sheet 2, part 2 of 2]

### Parts
IC138  74LS74N  [DIL14]
IC139  74LS74N  [DIL14]
IC140  74H40N  74S20N  [DIL14]
IC141  74H40N  74S20N  [DIL14]
IC142  74H40N  74S20N  [DIL14]
M916_19  M602  M916  [H807]
M916_20  M307  M916  [H807]
M916_21  M401  M916  [H807]
M916_22  M302  M916  [H807]
M916_23  M602  M916  [H807]

### Nets
1_TO_DF: IC138.3(A:CLK) ; also sheet 1
1_TO_DTF: IC139.3(A:CLK) ; also sheet 1
76+77: IC142.8(B:O) ; also sheet 1
!0_TO_LPB: IC141.8(B:O) ; also sheet 1
!76: IC142.9(B:I0) IC142.10(B:I1) ; also sheet 1
!77: IC142.12(B:I2) IC142.13(B:I3) ; also sheet 1
!CLR_DF: IC138.4(A:PRE) ; also sheet 1
!CLR_DTF: IC139.4(A:PRE) ; also sheet 1
!DF: IC138.5(A:Q) ; also sheet 1
!DTF: IC139.5(A:Q) ; also sheet 1
!M-STOP: M916_20.L1 ; also sheet 1
!MB_TO_DTB: IC140.9(B:I0) IC140.10(B:I1) IC140.12(B:I2) IC140.13(B:I3) IC141.6(A:O)
!SP_DY: M916_20.F2 ; also sheet 1
!ST_CK_0P: M916_23.L2 ; also sheet 1
!TM_EN: M916_21.J2 M916_21.K2 ; also sheet 1
!TS03: M916_23.H2 M916_23.J2 M916_23.K2 ; also sheet 1
!U+M_DY: M916_20.E2 M916_20.N1 ; also sheet 1
!WC: IC138.2(A:D) IC138.8(B:!Q) ; also sheet 1
!WC0: IC138.10(B:PRE) ; also sheet 1
!XSAD: M916_19.L2 ; also sheet 1
!XSTA: M916_19.H2 M916_19.J2 M916_19.K2 M916_20.K2 M916_20.L2 M916_22.M2 M916_22.N2 ; also sheet 1
+3V@D10U1: IC138.1(A:CLR) IC138.13(B:CLR) IC139.1(A:CLR) M916_20.M1 ; also sheet 1
B-BRK: IC141.1(A:I0) ; also sheet 1
B-XSTA: IC140.6(A:O) ; also sheet 1
BMB_TO_DTB: IC140.8(B:O) ; also sheet 1
CSTA: M916_22.P2 ; also sheet 1
DF: IC138.6(A:!Q) ; also sheet 1
DTF: IC139.6(A:!Q) ; also sheet 1
FR_01: IC141.5(A:I3) ; also sheet 1
GND: IC138.12(B:D) IC139.2(A:D) M916_19.C2 M916_19.T1 M916_20.C2 M916_20.T1 M916_21.C2 M916_21.T1 M916_22.C2 M916_22.T1 M916_23.C2 M916_23.T1 ; also sheet 1
MC02: IC141.9(B:I0) IC141.10(B:I1) ; also sheet 1
N$4: M916_19.R2 M916_19.S2
N$6: IC140.1(A:I0) IC140.2(A:I1) IC140.4(A:I2) IC140.5(A:I3) M916_19.F2
N$8: M916_23.F2 ; also sheet 1
N$12: M916_23.D2 M916_23.E2
N$17: M916_21.D2 ; also sheet 1
N$27: M916_21.N2 M916_21.S2
N$34: M916_22.T2 ; also sheet 1
N$40: M916_20.M2 M916_20.V2
N$41: M916_20.P1 M916_20.V1
N$67: M916_20.J2 ; also sheet 1
N$68: M916_20.D2 M916_20.H1
N$69: M916_20.A1 M916_20.C1
N$88: M916_23.R2 M916_23.S2
N$117: IC142.4(A:I2) IC142.5(A:I3) ; also sheet 1
N$118: IC142.1(A:I0) IC142.2(A:I1) ; also sheet 1
N$150: M916_22.S1 M916_22.S2
N$151: M916_22.R2 M916_22.V2
SP_DY: M916_20.H2
ST_CK: M916_23.M2 M916_23.N2 M916_23.P2 ; also sheet 1
ST_REV_CK: IC141.12(B:I2) IC141.13(B:I3) ; also sheet 1
T3: IC141.2(A:I1) IC141.4(A:I2) ; also sheet 1
T_TRK: M916_20.S1 M916_20.U1 ; also sheet 1
U+M_DY: M916_20.K1
VCC: M916_19.A2 M916_20.A2 M916_21.A2 M916_22.A2 M916_23.A2 ; also sheet 1
WC: IC138.9(B:Q) ; also sheet 1
XOR_TO_LPB: IC142.6(A:O) ; also sheet 1
XSTA: IC138.11(B:CLK) M916_19.M2 M916_19.N2 M916_19.P2 ; also sheet 1
Unconnected: IC139.8(B:!Q) IC139.9(B:Q) IC139.10(B:PRE) IC139.11(B:CLK) IC139.12(B:D) IC139.13(B:CLR) M916_19.A1 M916_19.B1 M916_19.B2 M916_19.C1 M916_19.D1 M916_19.D2 M916_19.E1 M916_19.E2 M916_19.F1 M916_19.H1 M916_19.J1 M916_19.K1 M916_19.L1 M916_19.M1 M916_19.N1 M916_19.P1 M916_19.R1 M916_19.S1 M916_19.T2 M916_19.U1 M916_19.U2 M916_19.V1 M916_19.V2 M916_20.B1 M916_20.B2 M916_20.D1 M916_20.E1 M916_20.F1 M916_20.J1 M916_20.N2 M916_20.P2 M916_20.R1 M916_20.R2 M916_20.S2 M916_20.T2 M916_20.U2 M916_21.A1 M916_21.B1 M916_21.B2 M916_21.C1 M916_21.D1 M916_21.E1 M916_21.E2 M916_21.F1 M916_21.F2 M916_21.H1 M916_21.H2 M916_21.J1 M916_21.K1 M916_21.L1 M916_21.L2 M916_21.M1 M916_21.M2 M916_21.N1 M916_21.P1 M916_21.P2 M916_21.R1 M916_21.R2 M916_21.S1 M916_21.T2 M916_21.U1 M916_21.U2 M916_21.V1 M916_21.V2 M916_22.A1 M916_22.B1 M916_22.B2 M916_22.C1 M916_22.D1 M916_22.D2 M916_22.E1 M916_22.E2 M916_22.F1 M916_22.F2 M916_22.H1 M916_22.H2 M916_22.J1 M916_22.J2 M916_22.K1 M916_22.K2 M916_22.L1 M916_22.L2 M916_22.M1 M916_22.N1 M916_22.P1 M916_22.R1 M916_22.U1 M916_22.U2 M916_22.V1 M916_23.A1 M916_23.B1 M916_23.B2 M916_23.C1 M916_23.D1 M916_23.E1 M916_23.F1 M916_23.H1 M916_23.J1 M916_23.K1 M916_23.L1 M916_23.M1 M916_23.N1 M916_23.P1 M916_23.R1 M916_23.S1 M916_23.T2 M916_23.U1 M916_23.U2 M916_23.V1 M916_23.V2

## Power pins joined to a net without a drawn wire
GND: IC1.12(GND) IC2.7(P:GND) IC3.7(P:GND) IC4.7(P:GND) IC5.7(P:GND) IC6.7(P:GND) IC7.7(P:GND) IC8.7(P:GND) IC9.7(P:GND) IC10.7(P:GND) IC11.7(P:GND) IC12.7(P:GND) IC13.7(P:GND) IC14.7(P:GND) IC15.7(P:GND) IC16.7(P:GND) IC17.7(P:GND) IC18.7(P:GND) IC19.7(P:GND) IC20.7(P:GND) IC21.7(P:GND) IC22.7(P:GND) IC23.7(P:GND) IC24.7(P:GND) IC25.4(P:GND) IC26.4(P:GND) IC27.4(P:GND) IC28.4(P:GND) IC29.4(P:GND) IC30.4(P:GND) IC31.7(P:GND) IC32.7(P:GND) IC33.7(P:GND) IC34.4(P:GND) IC35.4(P:GND) IC36.4(P:GND) IC37.4(P:GND) IC38.4(P:GND) IC39.7(P:GND) IC40.7(P:GND) IC41.4(P:GND) IC42.4(P:GND) IC43.4(P:GND) IC44.4(P:GND) IC45.4(P:GND) IC46.7(P:GND) IC47.7(P:GND) IC48.7(P:GND) IC49.4(P:GND) IC50.4(P:GND) IC51.4(P:GND) IC52.4(P:GND) IC53.4(P:GND) IC54.7(P:GND) IC55.7(P:GND) IC56.11(P:GND) IC57.11(P:GND) IC58.11(P:GND) IC59.7(P:GND) IC60.7(P:GND) IC61.7(P:GND) IC62.7(P:GND) IC63.7(P:GND) IC64.7(P:GND) IC65.7(P:GND) IC66.7(P:GND) IC67.7(P:GND) IC68.7(P:GND) IC69.7(P:GND) IC70.7(P:GND) IC71.7(P:GND) IC72.7(P:GND) IC73.7(P:GND) IC74.7(P:GND) IC75.7(P:GND) IC76.7(P:GND) IC77.7(P:GND) IC78.7(P:GND) IC79.7(P:GND) IC80.7(P:GND) IC81.7(P:GND) IC82.7(P:GND) IC83.7(P:GND) IC84.7(P:GND) IC85.7(P:GND) IC86.7(GND) IC87.7(P:GND) IC88.7(P:GND) IC89.7(P:GND) IC90.7(GND) IC91.7(P:GND) IC92.7(P:GND) IC93.7(P:GND) IC94.7(P:GND) IC95.11(P:GND) IC96.11(P:GND) IC97.7(GND) IC98.7(GND) IC99.7(GND) IC100.7(P:GND) IC101.7(P:GND) IC102.7(P:GND) IC103.7(GND) IC104.7(GND) IC105.7(GND) IC106.7(P:GND) IC107.7(P:GND) IC108.7(P:GND) IC109.7(P:GND) IC110.7(P:GND) IC111.7(P:GND) IC112.7(P:GND) IC113.7(P:GND) IC114.7(P:GND) IC115.7(P:GND) IC116.7(P:GND) IC117.7(P:GND) IC118.7(P:GND) IC119.7(P:GND) IC120.7(P:GND) IC121.7(P:GND) IC122.7(P:GND) IC123.7(P:GND) IC124.7(P:GND) IC125.12(GND) IC126.7(P:GND) IC127.11(P:GND) IC128.11(P:GND) IC129.11(P:GND) IC130.7(GND) IC131.7(GND) IC132.7(GND) IC133.7(GND) IC134.7(GND) IC135.7(GND) IC136.7(P:GND) IC137.7(P:GND) IC138.7(P:GND) IC139.7(P:GND) IC140.7(P:GND) IC141.7(P:GND) IC142.7(P:GND)
VCC: IC1.24(VCC) IC2.14(P:VCC) IC3.14(P:VCC) IC4.14(P:VCC) IC5.14(P:VCC) IC6.14(P:VCC) IC7.14(P:VCC) IC8.14(P:VCC) IC9.14(P:VCC) IC10.14(P:VCC) IC11.14(P:VCC) IC12.14(P:VCC) IC13.14(P:VCC) IC14.14(P:VCC) IC15.14(P:VCC) IC16.14(P:VCC) IC17.14(P:VCC) IC18.14(P:VCC) IC19.14(P:VCC) IC20.14(P:VCC) IC21.14(P:VCC) IC22.14(P:VCC) IC23.14(P:VCC) IC24.14(P:VCC) IC25.8(P:VCC) IC26.8(P:VCC) IC27.8(P:VCC) IC28.8(P:VCC) IC29.8(P:VCC) IC30.8(P:VCC) IC31.14(P:VCC) IC32.14(P:VCC) IC33.14(P:VCC) IC34.8(P:VCC) IC35.8(P:VCC) IC36.8(P:VCC) IC37.8(P:VCC) IC38.8(P:VCC) IC39.14(P:VCC) IC40.14(P:VCC) IC41.8(P:VCC) IC42.8(P:VCC) IC43.8(P:VCC) IC44.8(P:VCC) IC45.8(P:VCC) IC46.14(P:VCC) IC47.14(P:VCC) IC48.14(P:VCC) IC49.8(P:VCC) IC50.8(P:VCC) IC51.8(P:VCC) IC52.8(P:VCC) IC53.8(P:VCC) IC54.14(P:VCC) IC55.14(P:VCC) IC56.4(P:VCC) IC57.4(P:VCC) IC58.4(P:VCC) IC59.14(P:VCC) IC60.14(P:VCC) IC61.14(P:VCC) IC62.14(P:VCC) IC63.14(P:VCC) IC64.14(P:VCC) IC65.14(P:VCC) IC66.14(P:VCC) IC67.14(P:VCC) IC68.14(P:VCC) IC69.14(P:VCC) IC70.14(P:VCC) IC71.14(P:VCC) IC72.14(P:VCC) IC73.14(P:VCC) IC74.14(P:VCC) IC75.14(P:VCC) IC76.14(P:VCC) IC77.14(P:VCC) IC78.14(P:VCC) IC79.14(P:VCC) IC80.14(P:VCC) IC81.14(P:VCC) IC82.14(P:VCC) IC83.14(P:VCC) IC84.14(P:VCC) IC85.14(P:VCC) IC86.14(VCC) IC87.14(P:VCC) IC88.14(P:VCC) IC89.14(P:VCC) IC90.14(VCC) IC91.14(P:VCC) IC92.14(P:VCC) IC93.14(P:VCC) IC94.14(P:VCC) IC95.4(P:VCC) IC96.4(P:VCC) IC97.14(VCC) IC98.14(VCC) IC99.14(VCC) IC100.14(P:VCC) IC101.14(P:VCC) IC102.14(P:VCC) IC103.14(VCC) IC104.14(VCC) IC105.14(VCC) IC106.14(P:VCC) IC107.14(P:VCC) IC108.14(P:VCC) IC109.14(P:VCC) IC110.14(P:VCC) IC111.14(P:VCC) IC112.14(P:VCC) IC113.14(P:VCC) IC114.14(P:VCC) IC115.14(P:VCC) IC116.14(P:VCC) IC117.14(P:VCC) IC118.14(P:VCC) IC119.14(P:VCC) IC120.14(P:VCC) IC121.14(P:VCC) IC122.14(P:VCC) IC123.14(P:VCC) IC124.14(P:VCC) IC125.24(VCC) IC126.14(P:VCC) IC127.4(P:VCC) IC128.4(P:VCC) IC129.4(P:VCC) IC130.14(VCC) IC131.14(VCC) IC132.14(VCC) IC133.14(VCC) IC134.14(VCC) IC135.14(VCC) IC136.14(P:VCC) IC137.14(P:VCC) IC138.14(P:VCC) IC139.14(P:VCC) IC140.14(P:VCC) IC141.14(P:VCC) IC142.14(P:VCC)

## Library data of the parts
IC1 IC125 = 74xx-us:74*154: 4-line to 16-line data SELECTOR/MULTIPLEXER
IC2 IC68 IC69 IC108-IC110 = 74xx-us:74*10: Triple 3-input NAND gate
IC3 IC4 IC14-IC16 IC54 IC55 IC88 IC92-IC94 IC111-IC113 IC123 IC124 IC126 IC136 = 74xx-us:74*04: Hex INVERTER
IC5-IC7 IC62-IC64 IC73-IC77 IC100-IC102 IC114-IC116 IC137-IC139 = 74xx-us:74*74: Dual D type positive edge triggered FLIP FLOP, preset and clear
IC8-IC10 IC19-IC21 IC65-IC67 IC70-IC72 IC120-IC122 IC140-IC142 = 74xx-us:74*20: Dual 4-input NAND gate
IC11-IC13 IC17 IC18 IC59-IC61 IC78-IC85 IC87 IC89 IC91 IC106 IC107 IC117-IC119 = 74xx-us:74*00: Quad 2-input NAND gate
IC22-IC24 IC31-IC33 IC39 IC40 IC46-IC48 = 74xx-us:74*02: Quad 2-input NOR gate
IC25-IC30 IC34-IC38 IC41-IC45 IC49-IC53 = dec-con:DS75452: Quad 2-input NAND gate, open collector output
IC56-IC58 IC95 IC96 IC127-IC129 = 74xx-us:74*73: Dual J-K FLIP FLOP, clear
IC86 IC90 IC133-IC135 = 74xx-us:74*30: 8-input NAND gate
IC97-IC99 IC103-IC105 IC130-IC132 = 74xx-us:74*51: AND-OR-INVERT gates/for S-type see 74S51 <DEVICE:74S51>
M916_1-M916_23 = dec-m:M916: Simple 36 pin connector/wire cable
SV1-SV5 SV8-SV12 = dec-con:DEC40PIN: PIN HEADER
SV6 SV7 = con-lstb:MA17-2: PIN HEADER; OC_FARNELL: unknown; OC_NEWARK: unknown